# Altium project foxbms2-master.PrjPcb (part 1 of 8)
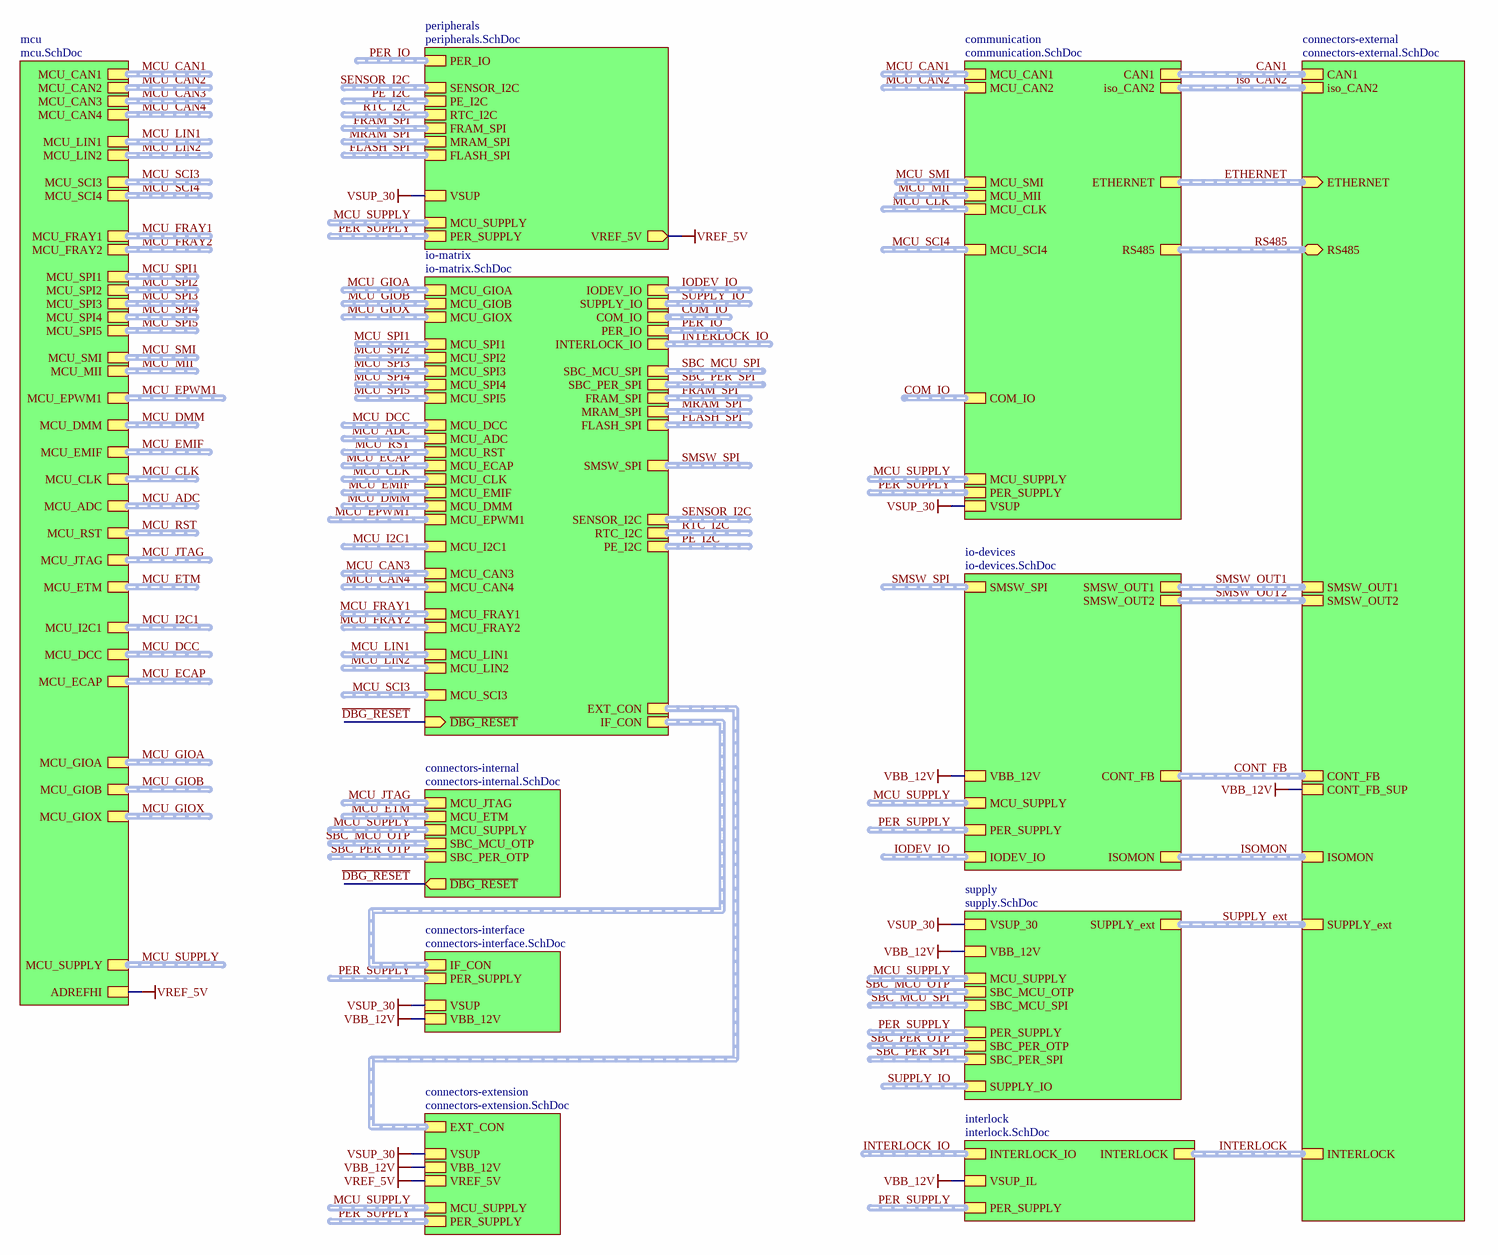
[diagram p0: foxbms2-master.SchDoc]
GlobalDate: 2022-10-25; GlobalLicense: Creative Commons Attribution 4.0; GlobalProject: foxBMS 2 Master; GlobalVersion: 1.1.5
46 sheets, 900 parts. Net scope: strictly hierarchical (ports join the sheet entries above them; power ports are local).
Board file: foxbms2-master.PcbDoc
Sheets:
  foxbms2-master.SchDoc
    mcu = mcu.SchDoc
      mcu-com-gpio-tim = mcu-com-gpio-tim.SchDoc
      mcu-supply = mcu-supply.SchDoc
      mcu-emif-etm-dmm = mcu-emif-etm-dmm.SchDoc
      mcu-misc = mcu-misc.SchDoc
      mcu-adc = mcu-adc.SchDoc
    connectors-external = connectors-external.SchDoc
    connectors-internal = connectors-internal.SchDoc
    communication = communication.SchDoc
      can = can.SchDoc
        can-transceiver1 = can-transceiver.SchDoc
        can-transceiver2 = can-transceiver.SchDoc
        digital-isolator-can = digital-isolator-3in-1out-power.SchDoc
      ethernet = ethernet.SchDoc
        ethernet-phy = ethernet-phy.SchDoc
      uart = uart.SchDoc
        rs232-rs485-transceiver = rs232-rs485-transceiver.SchDoc
    peripherals = peripherals.SchDoc
      clock = clock.SchDoc
        oscillator-20MHz = oscillator-20MHz.SchDoc
        oscillator-25MHz = oscillator-25MHz.SchDoc
      window-watchdog = window-watchdog.SchDoc
      memory = memory.SchDoc
        fram = fram.SchDoc
        mram = mram.SchDoc
        flash = flash.SchDoc
      sensor-hum-temp = sensor-hum-temp.SchDoc
      rtc = rtc.SchDoc
      port-expanders = port-expanders.SchDoc
        port-expander1 = port-expander.SchDoc
        port-expander2 = port-expander.SchDoc
        port-expander3 = port-expander.SchDoc
      vref-5.0V = voltage-reference-5.0V.SchDoc
    io-devices = io-devices.SchDoc
      smart-switches = smart-switches.SchDoc
        smart-switch1 = smart-switch.SchDoc
        smart-switch2 = smart-switch.SchDoc
      contactor-feedback = contactor-feedback.SchDoc
        contactor-feedback-divider1 = contactor-feedback-divider.SchDoc
        contactor-feedback-divider2 = contactor-feedback-divider.SchDoc
        contactor-feedback-divider3 = contactor-feedback-divider.SchDoc
        contactor-feedback-divider4 = contactor-feedback-divider.SchDoc
        contactor-feedback-divider5 = contactor-feedback-divider.SchDoc
        contactor-feedback-divider6 = contactor-feedback-divider.SchDoc
        contactor-feedback-divider7 = contactor-feedback-divider.SchDoc
        contactor-feedback-divider8 = contactor-feedback-divider.SchDoc
      insulation-monitoring = insulation-monitoring.SchDoc
    supply = supply.SchDoc
      buck-boost-converter = buck-boost-converter.SchDoc
      supply-protection-30 = supply-protection.SchDoc
      sbcs = sbcs.SchDoc
        sbc-mcu = sbc-base.SchDoc
        sbc-per = sbc-base.SchDoc
      supply-protection-30C = supply-protection.SchDoc
    io-matrix = io-matrix.SchDoc
    interlock = interlock.SchDoc
    connectors-interface = connectors-interface.SchDoc
    connectors-extension = connectors-extension.SchDoc

## Sheet foxbms2-master.SchDoc
size A3; SheetDescription: Top-Level Structure of foxBMS 2 Master; DocumentNumber: 1; SheetNumber: 1; SheetTotal: 45

### Sub-sheets
communication = communication.SchDoc: VSUP, PER_SUPPLY (harness PER_SUPPLY), MCU_SUPPLY (harness MCU_SUPPLY), iso_CAN2 (harness CAN), CAN1 (harness CAN), ETHERNET (harness ETHERNET), MCU_MII (harness MCU_MII), MCU_SMI (harness MCU_SMI), MCU_CLK (harness CLOCK), MCU_SCI4 (harness MCU_SCI), MCU_CAN2 (harness MCU_CAN), MCU_CAN1 (harness MCU_CAN), COM_IO (harness COM_IO), RS485 (harness RS485)
connectors-extension = connectors-extension.SchDoc: PER_SUPPLY (harness PER_SUPPLY), VBB_12V, VSUP, EXT_CON (harness EXT_CON), MCU_SUPPLY (harness MCU_SUPPLY), VREF_5V
connectors-external = connectors-external.SchDoc: ETHERNET (in, harness ETHERNET), iso_CAN2 (harness CAN), CAN1 (harness CAN), SMSW_OUT1 (harness SMSW_OUT), SMSW_OUT2 (harness SMSW_OUT), SUPPLY_ext (harness SUPPLY_EXT), CONT_FB_SUP, CONT_FB (harness PE_IO), ISOMON (harness ISOMON), INTERLOCK (harness INTERLOCK), RS485 (bidir, harness RS485)
connectors-interface = connectors-interface.SchDoc: PER_SUPPLY (harness PER_SUPPLY), IF_CON (harness INTERFACE_CON), VBB_12V, VSUP
connectors-internal = connectors-internal.SchDoc: MCU_JTAG (harness MCU_JTAG), SBC_MCU_OTP (harness SBC_OTP), SBC_PER_OTP (harness SBC_OTP), MCU_ETM (harness MCU_ETM), MCU_SUPPLY (harness MCU_SUPPLY), ~{DBG_RESET} (out)
interlock = interlock.SchDoc: PER_SUPPLY (harness PER_SUPPLY), VSUP_IL, INTERLOCK_IO (harness INTERLOCK_IO), INTERLOCK (harness INTERLOCK)
io-devices = io-devices.SchDoc: CONT_FB (harness PE_IO), SMSW_OUT1 (harness SMSW_OUT), SMSW_OUT2 (harness SMSW_OUT), ISOMON (harness ISOMON), IODEV_IO (harness IODEV_IO), SMSW_SPI (harness SPI), VBB_12V, PER_SUPPLY (harness PER_SUPPLY), MCU_SUPPLY (harness MCU_SUPPLY)
io-matrix = io-matrix.SchDoc: IODEV_IO (harness IODEV_IO), COM_IO (harness COM_IO), MCU_GIOB (harness MCU_GIOB), MCU_GIOA (harness MCU_GIOA), MCU_GIOX (harness MCU_GIOX), SBC_MCU_SPI (harness SPI), FRAM_SPI (harness SPI), MCU_SPI1 (harness MCU_SPI1), MCU_SPI2 (harness MCU_SPI2), MCU_SPI4 (harness MCU_SPI4), MRAM_SPI (harness SPI), SENSOR_I2C (harness I2C), MCU_DCC (harness MCU_DCC), MCU_ADC (harness MCU_ADC), MCU_RST (harness MCU_RST), RTC_I2C (harness I2C), FLASH_SPI (harness SPI), MCU_ECAP (harness MCU_ECAP), PE_I2C (harness I2C), SBC_PER_SPI (harness SPI), MCU_CLK (harness CLOCK), SMSW_SPI (harness SPI), INTERLOCK_IO (harness INTERLOCK_IO), SUPPLY_IO (harness SUPPLY_IO), PER_IO (harness PER_IO), ~{DBG_RESET} (in), MCU_SPI5 (harness MCU_SPI5), EXT_CON (harness EXT_CON), IF_CON (harness INTERFACE_CON), MCU_SPI3 (harness MCU_SPI3), MCU_I2C1 (harness MCU_I2C), MCU_LIN2 (harness MCU_LIN), MCU_FRAY1 (harness MCU_FRAY), MCU_FRAY2 (harness MCU_FRAY), MCU_LIN1 (harness MCU_LIN), MCU_EMIF (harness MCU_EMIF), MCU_EPWM1 (harness MCU_EPWM), MCU_DMM (harness MCU_DMM), MCU_CAN3 (harness MCU_CAN), MCU_CAN4 (harness MCU_CAN), MCU_SCI3 (harness MCU_SCI)
mcu = mcu.SchDoc: ADREFHI, MCU_EPWM1 (harness MCU_EPWM), MCU_LIN2 (harness MCU_LIN), MCU_FRAY2 (harness MCU_FRAY), MCU_CAN4 (harness MCU_CAN), MCU_CAN3 (harness MCU_CAN), MCU_SPI2 (harness MCU_SPI2), MCU_SCI3 (harness MCU_SCI), MCU_CAN1 (harness MCU_CAN), MCU_DMM (harness MCU_DMM), MCU_EMIF (harness MCU_EMIF), MCU_CLK (harness CLOCK), MCU_RST (harness MCU_RST), MCU_JTAG (harness MCU_JTAG), MCU_ETM (harness MCU_ETM), MCU_CAN2 (harness MCU_CAN), MCU_SPI5 (harness MCU_SPI5), MCU_SPI4 (harness MCU_SPI4), MCU_I2C1 (harness MCU_I2C), MCU_SMI (harness MCU_SMI), MCU_SPI3 (harness MCU_SPI3), MCU_MII (harness MCU_MII), MCU_SPI1 (harness MCU_SPI1), MCU_LIN1 (harness MCU_LIN), MCU_FRAY1 (harness MCU_FRAY), MCU_SCI4 (harness MCU_SCI), MCU_SUPPLY (harness MCU_SUPPLY), MCU_GIOB (harness MCU_GIOB), MCU_GIOA (harness MCU_GIOA), MCU_DCC (harness MCU_DCC), MCU_ECAP (harness MCU_ECAP), MCU_ADC (harness MCU_ADC), MCU_GIOX (harness MCU_GIOX)
peripherals = peripherals.SchDoc: MCU_SUPPLY (harness MCU_SUPPLY), PER_SUPPLY (harness PER_SUPPLY), VSUP, SENSOR_I2C (harness I2C), PE_I2C (harness I2C), RTC_I2C (harness I2C), MRAM_SPI (harness SPI), FLASH_SPI (harness SPI), FRAM_SPI (harness SPI), PER_IO (harness PER_IO), VREF_5V (out)
supply = supply.SchDoc: SBC_PER_OTP (harness SBC_OTP), SBC_MCU_OTP (harness SBC_OTP), PER_SUPPLY (harness PER_SUPPLY), MCU_SUPPLY (harness MCU_SUPPLY), SUPPLY_ext (harness SUPPLY_EXT), VSUP_30, VBB_12V, SBC_PER_SPI (harness SPI), SUPPLY_IO (harness SUPPLY_IO), SBC_MCU_SPI (harness SPI)

### Nets
VBB_12V: sheet connectors-external/CONT_FB_SUP, sheet io-devices/VBB_12V, sheet supply/VBB_12V, sheet interlock/VSUP_IL, sheet connectors-interface/VBB_12V, sheet connectors-extension/VBB_12V
VREF_5V: sheet mcu/ADREFHI, sheet peripherals/VREF_5V, sheet connectors-extension/VREF_5V
VSUP_30: sheet communication/VSUP, sheet peripherals/VSUP, sheet supply/VSUP_30, sheet connectors-interface/VSUP, sheet connectors-extension/VSUP
~{DBG_RESET}: sheet connectors-internal/~{DBG_RESET}, sheet io-matrix/~{DBG_RESET}

### Buses and harness runs
harness CAN1 = sheet communication/CAN1 = sheet connectors-external/CAN1
harness COM_IO = sheet communication/COM_IO
harness COM_IO = sheet io-matrix/COM_IO
harness CONT_FB = sheet connectors-external/CONT_FB = sheet io-devices/CONT_FB
harness ETHERNET = sheet communication/ETHERNET = sheet connectors-external/ETHERNET
harness FLASH_SPI = sheet io-matrix/FLASH_SPI
harness FLASH_SPI = sheet peripherals/FLASH_SPI
harness FRAM_SPI = sheet io-matrix/FRAM_SPI
harness FRAM_SPI = sheet peripherals/FRAM_SPI
harness INTERLOCK = sheet connectors-external/INTERLOCK = sheet interlock/INTERLOCK
harness INTERLOCK_IO = sheet interlock/INTERLOCK_IO
harness INTERLOCK_IO = sheet io-matrix/INTERLOCK_IO
harness IODEV_IO = sheet io-devices/IODEV_IO
harness IODEV_IO = sheet io-matrix/IODEV_IO
harness iso_CAN2 = sheet communication/iso_CAN2 = sheet connectors-external/iso_CAN2
harness ISOMON = sheet connectors-external/ISOMON = sheet io-devices/ISOMON
harness MCU_ADC = sheet io-matrix/MCU_ADC
harness MCU_ADC = sheet mcu/MCU_ADC
harness MCU_CAN1 = sheet communication/MCU_CAN1
harness MCU_CAN1 = sheet mcu/MCU_CAN1
harness MCU_CAN2 = sheet communication/MCU_CAN2
harness MCU_CAN2 = sheet mcu/MCU_CAN2
harness MCU_CAN3 = sheet io-matrix/MCU_CAN3
harness MCU_CAN3 = sheet mcu/MCU_CAN3
harness MCU_CAN4 = sheet io-matrix/MCU_CAN4
harness MCU_CAN4 = sheet mcu/MCU_CAN4
harness MCU_CLK = sheet communication/MCU_CLK
harness MCU_CLK = sheet io-matrix/MCU_CLK
harness MCU_CLK = sheet mcu/MCU_CLK
harness MCU_DCC = sheet io-matrix/MCU_DCC
harness MCU_DCC = sheet mcu/MCU_DCC
harness MCU_DMM = sheet io-matrix/MCU_DMM
harness MCU_DMM = sheet mcu/MCU_DMM
harness MCU_ECAP = sheet io-matrix/MCU_ECAP
harness MCU_ECAP = sheet mcu/MCU_ECAP
harness MCU_EMIF = sheet io-matrix/MCU_EMIF
harness MCU_EMIF = sheet mcu/MCU_EMIF
harness MCU_EPWM1 = sheet io-matrix/MCU_EPWM1
harness MCU_EPWM1 = sheet mcu/MCU_EPWM1
harness MCU_ETM = sheet connectors-internal/MCU_ETM
harness MCU_ETM = sheet mcu/MCU_ETM
harness MCU_FRAY1 = sheet io-matrix/MCU_FRAY1
harness MCU_FRAY1 = sheet mcu/MCU_FRAY1
harness MCU_FRAY2 = sheet io-matrix/MCU_FRAY2
harness MCU_FRAY2 = sheet mcu/MCU_FRAY2
harness MCU_GIOA = sheet io-matrix/MCU_GIOA
harness MCU_GIOA = sheet mcu/MCU_GIOA
harness MCU_GIOB = sheet io-matrix/MCU_GIOB
harness MCU_GIOB = sheet mcu/MCU_GIOB
harness MCU_GIOX = sheet io-matrix/MCU_GIOX
harness MCU_GIOX = sheet mcu/MCU_GIOX
harness MCU_I2C1 = sheet io-matrix/MCU_I2C1
harness MCU_I2C1 = sheet mcu/MCU_I2C1
harness MCU_JTAG = sheet connectors-internal/MCU_JTAG
harness MCU_JTAG = sheet mcu/MCU_JTAG
harness MCU_LIN1 = sheet io-matrix/MCU_LIN1
harness MCU_LIN1 = sheet mcu/MCU_LIN1
harness MCU_LIN2 = sheet io-matrix/MCU_LIN2
harness MCU_LIN2 = sheet mcu/MCU_LIN2
harness MCU_MII = sheet communication/MCU_MII
harness MCU_MII = sheet mcu/MCU_MII
harness MCU_RST = sheet io-matrix/MCU_RST
harness MCU_RST = sheet mcu/MCU_RST
harness MCU_SCI3 = sheet io-matrix/MCU_SCI3
harness MCU_SCI3 = sheet mcu/MCU_SCI3
harness MCU_SCI4 = sheet communication/MCU_SCI4
harness MCU_SCI4 = sheet mcu/MCU_SCI4
harness MCU_SMI = sheet communication/MCU_SMI
harness MCU_SMI = sheet mcu/MCU_SMI
harness MCU_SPI1 = sheet io-matrix/MCU_SPI1
harness MCU_SPI1 = sheet mcu/MCU_SPI1
harness MCU_SPI2 = sheet io-matrix/MCU_SPI2
harness MCU_SPI2 = sheet mcu/MCU_SPI2
harness MCU_SPI3 = sheet io-matrix/MCU_SPI3
harness MCU_SPI3 = sheet mcu/MCU_SPI3
harness MCU_SPI4 = sheet io-matrix/MCU_SPI4
harness MCU_SPI4 = sheet mcu/MCU_SPI4
harness MCU_SPI5 = sheet io-matrix/MCU_SPI5
harness MCU_SPI5 = sheet mcu/MCU_SPI5
harness MCU_SUPPLY = sheet communication/MCU_SUPPLY
harness MCU_SUPPLY = sheet connectors-extension/MCU_SUPPLY
harness MCU_SUPPLY = sheet connectors-internal/MCU_SUPPLY
harness MCU_SUPPLY = sheet io-devices/MCU_SUPPLY
harness MCU_SUPPLY = sheet mcu/MCU_SUPPLY
harness MCU_SUPPLY = sheet peripherals/MCU_SUPPLY
harness MCU_SUPPLY = sheet supply/MCU_SUPPLY
harness MRAM_SPI = sheet io-matrix/MRAM_SPI
harness MRAM_SPI = sheet peripherals/MRAM_SPI
harness PE_I2C = sheet io-matrix/PE_I2C
harness PE_I2C = sheet peripherals/PE_I2C
harness PER_IO = sheet io-matrix/PER_IO
harness PER_IO = sheet peripherals/PER_IO
harness PER_SUPPLY = sheet communication/PER_SUPPLY
harness PER_SUPPLY = sheet connectors-extension/PER_SUPPLY
harness PER_SUPPLY = sheet connectors-interface/PER_SUPPLY
harness PER_SUPPLY = sheet interlock/PER_SUPPLY
harness PER_SUPPLY = sheet io-devices/PER_SUPPLY
harness PER_SUPPLY = sheet peripherals/PER_SUPPLY
harness PER_SUPPLY = sheet supply/PER_SUPPLY
harness RS485 = sheet communication/RS485 = sheet connectors-external/RS485
harness RTC_I2C = sheet io-matrix/RTC_I2C
harness RTC_I2C = sheet peripherals/RTC_I2C
harness SBC_MCU_OTP = sheet connectors-internal/SBC_MCU_OTP
harness SBC_MCU_OTP = sheet supply/SBC_MCU_OTP
harness SBC_MCU_SPI = sheet io-matrix/SBC_MCU_SPI
harness SBC_MCU_SPI = sheet supply/SBC_MCU_SPI
harness SBC_PER_OTP = sheet connectors-internal/SBC_PER_OTP
harness SBC_PER_OTP = sheet supply/SBC_PER_OTP
harness SBC_PER_SPI = sheet io-matrix/SBC_PER_SPI
harness SBC_PER_SPI = sheet supply/SBC_PER_SPI
harness SENSOR_I2C = sheet io-matrix/SENSOR_I2C
harness SENSOR_I2C = sheet peripherals/SENSOR_I2C
harness sheet connectors-extension/EXT_CON = sheet io-matrix/EXT_CON
harness sheet connectors-interface/IF_CON = sheet io-matrix/IF_CON
harness SMSW_OUT1 = sheet connectors-external/SMSW_OUT1 = sheet io-devices/SMSW_OUT1
harness SMSW_OUT2 = sheet connectors-external/SMSW_OUT2 = sheet io-devices/SMSW_OUT2
harness SMSW_SPI = sheet io-devices/SMSW_SPI
harness SMSW_SPI = sheet io-matrix/SMSW_SPI
harness SUPPLY_ext = sheet connectors-external/SUPPLY_ext = sheet supply/SUPPLY_ext
harness SUPPLY_IO = sheet io-matrix/SUPPLY_IO
harness SUPPLY_IO = sheet supply/SUPPLY_IO

### Notes on the sheet
- Fraunhofer IISB
- Schottkystr. 10
- developed by:
- 91058 Erlangen
- Germany
- Author
- Project
- License
- Description
- File
- Version
- Release Date
- Sheet
- foxbms.org <https://foxbms.org>
- www.iisb.fraunhofer.de <https://www.iisb.fraunhofer.de/>
- foxBMS Team
- /

## Sheet mcu.SchDoc
size A3; DocumentNumber: 22; SheetNumber: 22; SheetTotal: 45; SheetDescription: Microcontroller Unit
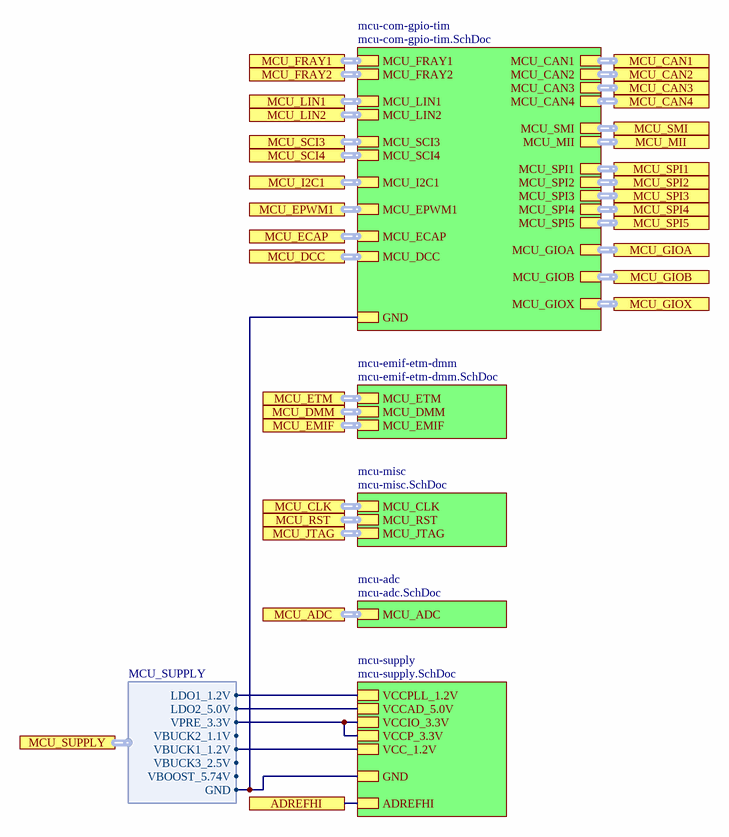
[diagram p1: mcu.SchDoc]

### Sub-sheets
mcu-adc = mcu-adc.SchDoc: MCU_ADC (harness MCU_ADC)
mcu-com-gpio-tim = mcu-com-gpio-tim.SchDoc: MCU_FRAY1 (harness MCU_FRAY), MCU_LIN1 (harness MCU_LIN), MCU_SPI1 (harness MCU_SPI1), MCU_MII (harness MCU_MII), MCU_SPI3 (harness MCU_SPI3), MCU_SMI (harness MCU_SMI), MCU_SPI5 (harness MCU_SPI5), MCU_LIN2 (harness MCU_LIN), MCU_SPI4 (harness MCU_SPI4), MCU_SPI2 (harness MCU_SPI2), MCU_EPWM1 (harness MCU_EPWM), MCU_I2C1 (harness MCU_I2C), MCU_SCI3 (harness MCU_SCI), MCU_CAN1 (harness MCU_CAN), MCU_CAN2 (harness MCU_CAN), MCU_FRAY2 (harness MCU_FRAY), MCU_CAN4 (harness MCU_CAN), MCU_CAN3 (harness MCU_CAN), MCU_SCI4 (harness MCU_SCI), MCU_ECAP (harness MCU_ECAP), MCU_DCC (harness MCU_DCC), MCU_GIOB (harness MCU_GIOB), MCU_GIOA (harness MCU_GIOA), GND, MCU_GIOX (harness MCU_GIOX)
mcu-emif-etm-dmm = mcu-emif-etm-dmm.SchDoc: MCU_ETM (harness MCU_ETM), MCU_DMM (harness MCU_DMM), MCU_EMIF (harness MCU_EMIF)
mcu-misc = mcu-misc.SchDoc: MCU_CLK (harness CLOCK), MCU_RST (harness MCU_RST), MCU_JTAG (harness MCU_JTAG)
mcu-supply = mcu-supply.SchDoc: VCCP_3.3V, VCCAD_5.0V, VCCPLL_1.2V, VCC_1.2V, VCCIO_3.3V, GND, ADREFHI

### Ports
ADREFHI, MCU_ADC (harness MCU_ADC), MCU_CAN1 (harness MCU_CAN), MCU_CAN2 (harness MCU_CAN), MCU_CAN3 (harness MCU_CAN), MCU_CAN4 (harness MCU_CAN), MCU_CLK (harness CLOCK), MCU_DCC (harness MCU_DCC), MCU_DMM (harness MCU_DMM), MCU_ECAP (harness MCU_ECAP), MCU_EMIF (harness MCU_EMIF), MCU_EPWM1 (harness MCU_EPWM), MCU_ETM (harness MCU_ETM), MCU_FRAY1 (harness MCU_FRAY), MCU_FRAY2 (harness MCU_FRAY), MCU_GIOA (harness MCU_GIOA), MCU_GIOB (harness MCU_GIOB), MCU_GIOX (harness MCU_GIOX), MCU_I2C1 (harness MCU_I2C), MCU_JTAG (harness MCU_JTAG), MCU_LIN1 (harness MCU_LIN), MCU_LIN2 (harness MCU_LIN), MCU_MII (harness MCU_MII), MCU_RST (harness MCU_RST), MCU_SCI3 (harness MCU_SCI), MCU_SCI4 (harness MCU_SCI), MCU_SMI (harness MCU_SMI), MCU_SPI1 (harness MCU_SPI1), MCU_SPI2 (harness MCU_SPI2), MCU_SPI3 (harness MCU_SPI3), MCU_SPI4 (harness MCU_SPI4), MCU_SPI5 (harness MCU_SPI5), MCU_SUPPLY (harness MCU_SUPPLY)

### Harnesses
MCU_SUPPLY: VBUCK1_1.2V, VBUCK2_1.1V, VBUCK3_2.5V, LDO1_1.2V, LDO2_5.0V, GND, VPRE_3.3V, VBOOST_5.74V

### Nets
GND: sheet mcu-com-gpio-tim/GND, sheet mcu-supply/GND, port MCU_SUPPLY.GND
MCU_1.2V: sheet mcu-supply/VCC_1.2V, port MCU_SUPPLY.VBUCK1_1.2V
MCU_1.2V_LDO: sheet mcu-supply/VCCPLL_1.2V, port MCU_SUPPLY.LDO1_1.2V
MCU_3.3V: sheet mcu-supply/VCCP_3.3V, sheet mcu-supply/VCCIO_3.3V, port MCU_SUPPLY.VPRE_3.3V
MCU_5.0V_LDO: sheet mcu-supply/VCCAD_5.0V, port MCU_SUPPLY.LDO2_5.0V
VREF_5V: port ADREFHI, sheet mcu-supply/ADREFHI

### Buses and harness runs
harness port MCU_ADC = sheet mcu-adc/MCU_ADC
harness port MCU_CAN1 = sheet mcu-com-gpio-tim/MCU_CAN1
harness port MCU_CAN2 = sheet mcu-com-gpio-tim/MCU_CAN2
harness port MCU_CAN3 = sheet mcu-com-gpio-tim/MCU_CAN3
harness port MCU_CAN4 = sheet mcu-com-gpio-tim/MCU_CAN4
harness port MCU_CLK = sheet mcu-misc/MCU_CLK
harness port MCU_DCC = sheet mcu-com-gpio-tim/MCU_DCC
harness port MCU_DMM = sheet mcu-emif-etm-dmm/MCU_DMM
harness port MCU_ECAP = sheet mcu-com-gpio-tim/MCU_ECAP
harness port MCU_EMIF = sheet mcu-emif-etm-dmm/MCU_EMIF
harness port MCU_EPWM1 = sheet mcu-com-gpio-tim/MCU_EPWM1
harness port MCU_ETM = sheet mcu-emif-etm-dmm/MCU_ETM
harness port MCU_FRAY1 = sheet mcu-com-gpio-tim/MCU_FRAY1
harness port MCU_FRAY2 = sheet mcu-com-gpio-tim/MCU_FRAY2
harness port MCU_GIOA = sheet mcu-com-gpio-tim/MCU_GIOA
harness port MCU_GIOB = sheet mcu-com-gpio-tim/MCU_GIOB
harness port MCU_GIOX = sheet mcu-com-gpio-tim/MCU_GIOX
harness port MCU_I2C1 = sheet mcu-com-gpio-tim/MCU_I2C1
harness port MCU_JTAG = sheet mcu-misc/MCU_JTAG
harness port MCU_LIN1 = sheet mcu-com-gpio-tim/MCU_LIN1
harness port MCU_LIN2 = sheet mcu-com-gpio-tim/MCU_LIN2
harness port MCU_MII = sheet mcu-com-gpio-tim/MCU_MII
harness port MCU_RST = sheet mcu-misc/MCU_RST
harness port MCU_SCI3 = sheet mcu-com-gpio-tim/MCU_SCI3
harness port MCU_SCI4 = sheet mcu-com-gpio-tim/MCU_SCI4
harness port MCU_SMI = sheet mcu-com-gpio-tim/MCU_SMI
harness port MCU_SPI1 = sheet mcu-com-gpio-tim/MCU_SPI1
harness port MCU_SPI2 = sheet mcu-com-gpio-tim/MCU_SPI2
harness port MCU_SPI3 = sheet mcu-com-gpio-tim/MCU_SPI3
harness port MCU_SPI4 = sheet mcu-com-gpio-tim/MCU_SPI4
harness port MCU_SPI5 = sheet mcu-com-gpio-tim/MCU_SPI5

### Notes on the sheet
- Fraunhofer IISB
- Schottkystr. 10
- developed by:
- 91058 Erlangen
- Germany
- Author
- Project
- License
- Description
- File
- Version
- Release Date
- Sheet
- foxbms.org <https://foxbms.org>
- www.iisb.fraunhofer.de <https://www.iisb.fraunhofer.de/>
- foxBMS Team
- /

## Sheet mcu-com-gpio-tim.SchDoc
size A3; DocumentNumber: 24; SheetNumber: 24; SheetTotal: 45; SheetDescription: MCU COM, GPIO and TIM
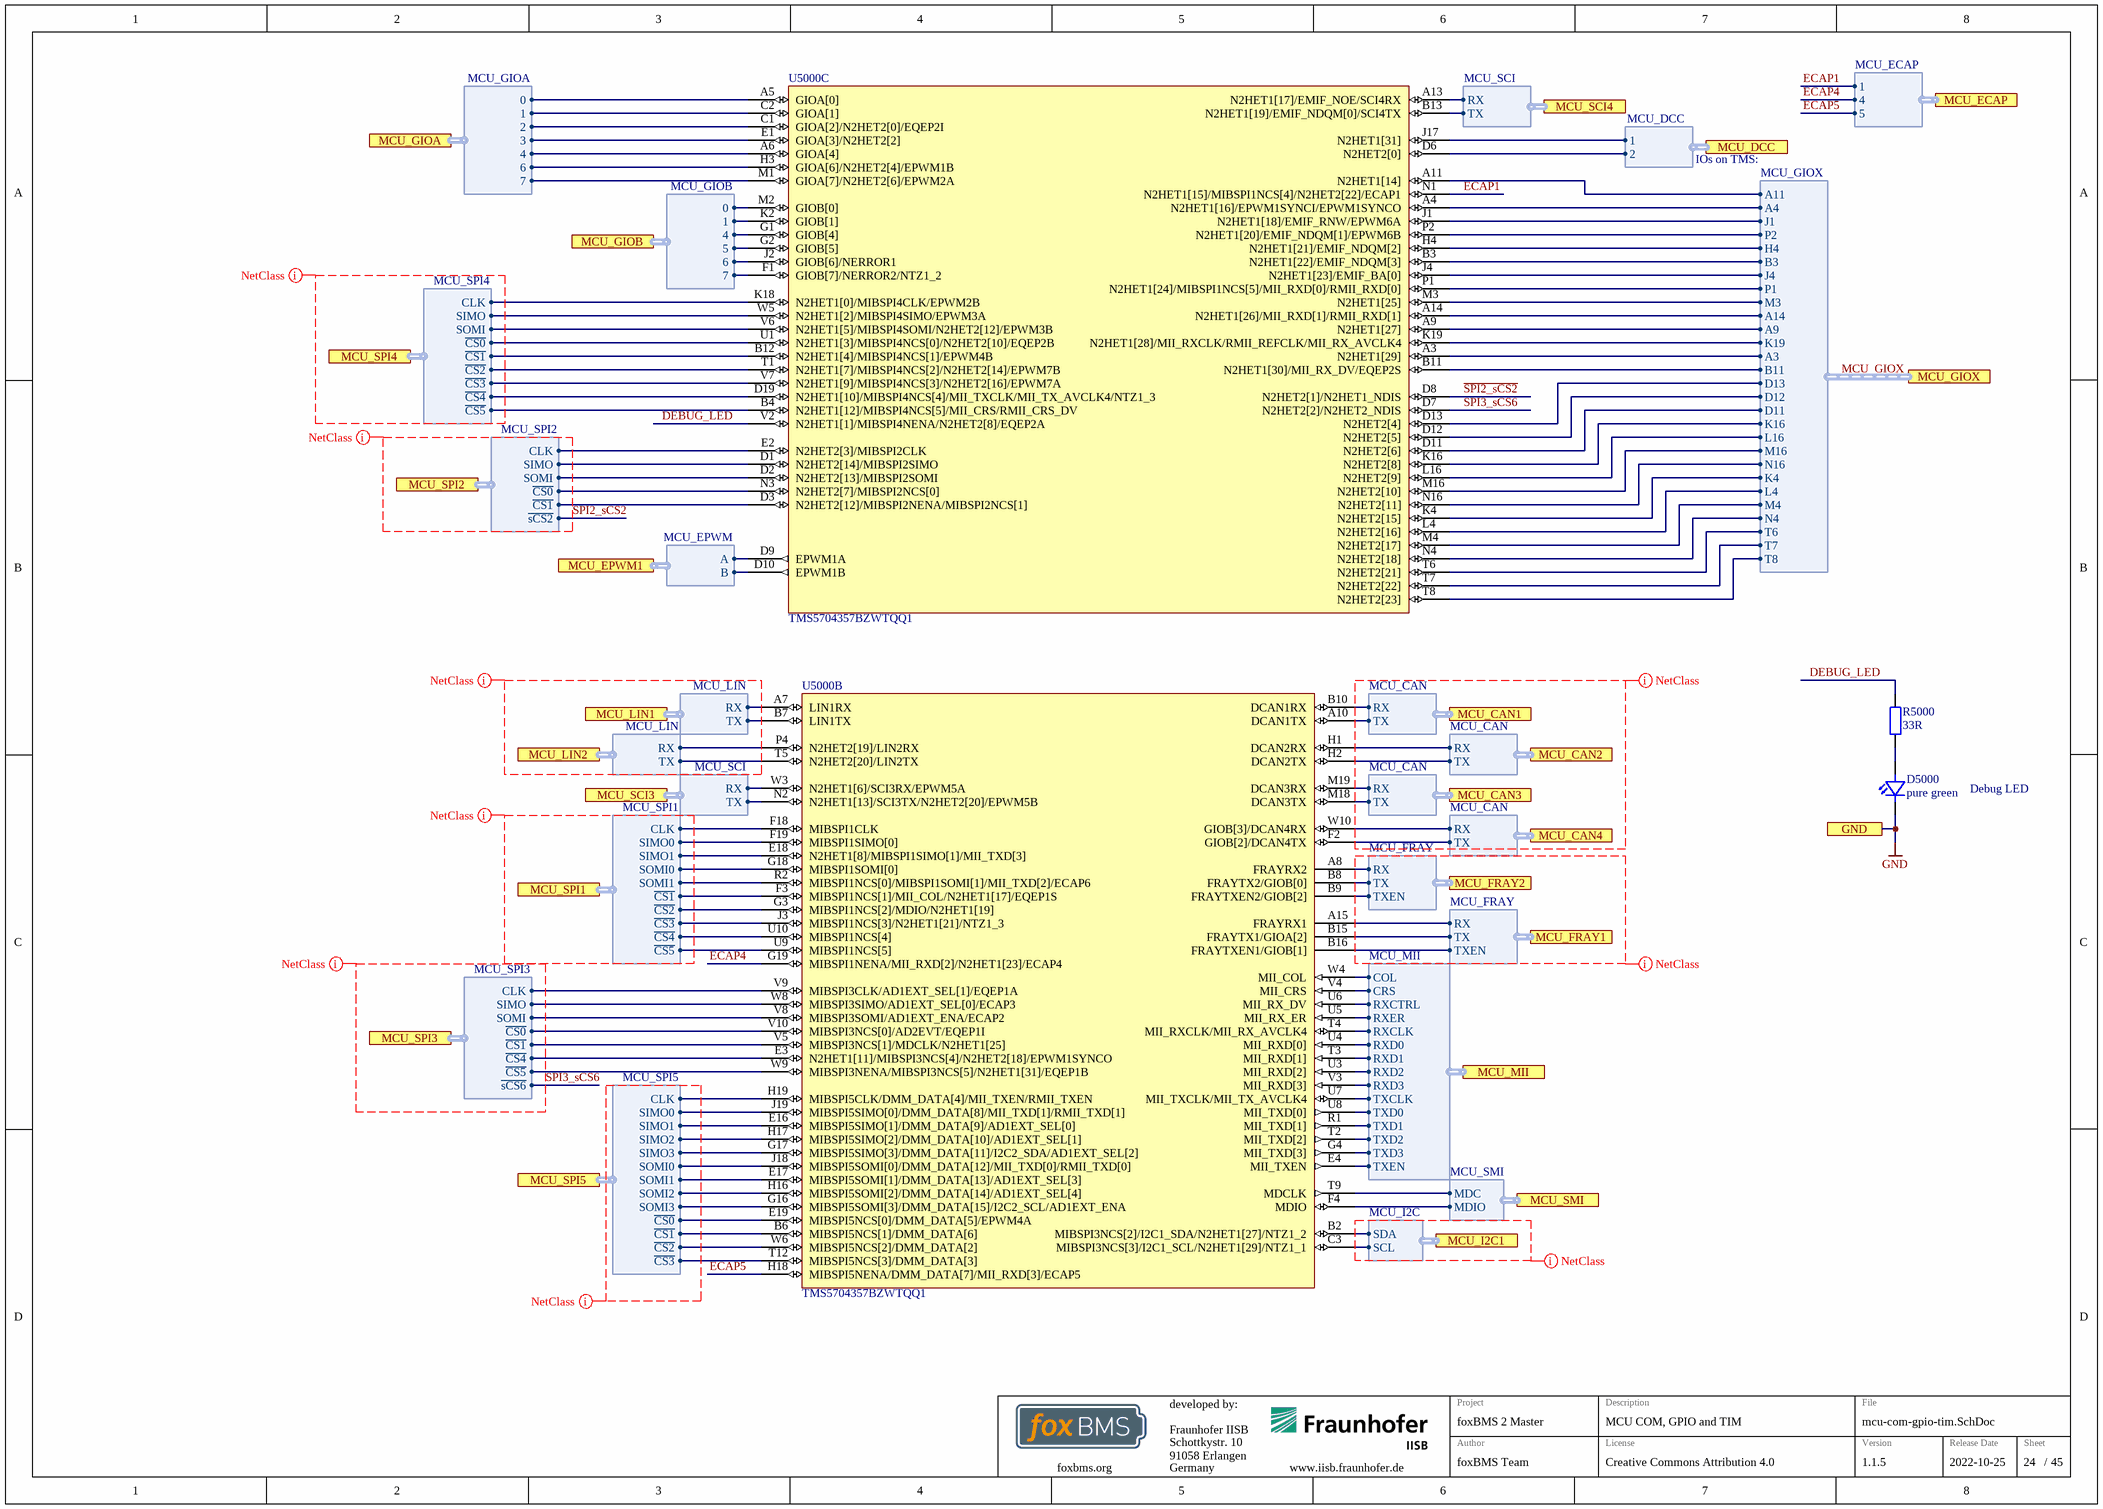
[diagram p2: mcu-com-gpio-tim.SchDoc]

### Parts
D5000  pure green  [LEDC1608X07N]
R5000  33R  [RESC1005X04N]
U5000  TMS5704357BZWTQQ1  [BGA337C80P19X19_1600X1600X140]  (parts B,C of 6)

### Ports
GND, MCU_CAN1 (harness MCU_CAN), MCU_CAN2 (harness MCU_CAN), MCU_CAN3 (harness MCU_CAN), MCU_CAN4 (harness MCU_CAN), MCU_DCC (harness MCU_DCC), MCU_ECAP (harness MCU_ECAP), MCU_EPWM1 (harness MCU_EPWM), MCU_FRAY1 (harness MCU_FRAY), MCU_FRAY2 (harness MCU_FRAY), MCU_GIOA (harness MCU_GIOA), MCU_GIOB (harness MCU_GIOB), MCU_GIOX (harness MCU_GIOX), MCU_I2C1 (harness MCU_I2C), MCU_LIN1 (harness MCU_LIN), MCU_LIN2 (harness MCU_LIN), MCU_MII (harness MCU_MII), MCU_SCI3 (harness MCU_SCI), MCU_SCI4 (harness MCU_SCI), MCU_SMI (harness MCU_SMI), MCU_SPI1 (harness MCU_SPI1), MCU_SPI2 (harness MCU_SPI2), MCU_SPI3 (harness MCU_SPI3), MCU_SPI4 (harness MCU_SPI4), MCU_SPI5 (harness MCU_SPI5)

### Harnesses
MCU_CAN: RX, TX
MCU_FRAY: RX, TX, TXEN
MCU_SMI: MDC, MDIO
MCU_MII: TXD0, TXD1, TXD2, TXD3, TXEN, TXCLK, RXCTRL, RXCLK, RXD3, RXD2, RXD0, RXD1, RXER, COL, CRS
MCU_LIN: RX, TX
MCU_SPI1: CLK, SIMO0, SOMI0, SOMI1, ~{CS1}, ~{CS2}, ~{CS3}, ~{CS4}, ~{CS5}, SIMO1
MCU_SPI3: CLK, SIMO, SOMI, ~{CS1}, ~{CS4}, ~{CS5}, ~{CS0}, ~{sCS6}
MCU_SPI5: CLK, SIMO0, SOMI0, SOMI1, ~{CS1}, ~{CS2}, ~{CS3}, ~{CS0}, SIMO1, SIMO2, SIMO3, SOMI2, SOMI3
MCU_SCI: RX, TX
MCU_I2C: SDA, SCL
MCU_SPI4: CLK, SIMO, SOMI, ~{CS1}, ~{CS2}, ~{CS3}, ~{CS0}, ~{CS4}, ~{CS5}
MCU_SPI2: CLK, SIMO, SOMI, ~{CS1}, ~{CS0}, ~{sCS2}
MCU_EPWM: A, B
MCU_GIOA: 0, 1, 2, 3, 4, 6, 7
MCU_GIOB: 0, 1, 4, 5, 6, 7
MCU_DCC: 1, 2
MCU_ECAP: 1, 4, 5
MCU_GIOX: A11, A4, J1, P2, H4, B3, J4, P1, M3, A14, A9, K19, A3, B11, D13, D12, D11, K16, L16, M16, N16, K4, L4, M4, N4, T6, T7, T8

### Nets
GND: D5000.1(C) U5000.V4(MII_CRS) U5000.W4(MII_COL) ; port GND, port MCU_MII.COL, port MCU_MII.CRS
~{SPI2_sCS2}: U5000.D8(N2HET2[1]/N2HET1_NDIS) ; port MCU_SPI2.~{sCS2}  [project net MCU_SPI2~{.}sCS2]
~{SPI3_sCS6}: U5000.D7(N2HET2[2]/N2HET2_NDIS) ; port MCU_SPI3.~{sCS6}  [project net MCU_SPI3~{.}sCS6]
COM_IO~{.}ETH_INT: U5000.J2(GIOB[6]/NERROR1) ; port MCU_GIOB.6
COM_IO.CAN_FAULT: U5000.G2(GIOB[5]) ; port MCU_GIOB.5
DEBUG_LED: R5000.2 U5000.V2(N2HET1[1]/MIBSPI4NENA/N2HET2[8]/EQEP2A)  [project net DEBUG_LED_24]
ECAP1: U5000.N1(N2HET1[15]/MIBSPI1NCS[4]/N2HET2[22]/ECAP1) ; port MCU_ECAP.1  [project net IODEV_IO.IM_PWM]
ECAP4: U5000.G19(MIBSPI1NENA/MII_RXD[2]/N2HET1[23]/ECAP4) ; port MCU_ECAP.4  [project net EXT_CON.ECAP4]
ECAP5: U5000.H18(MIBSPI5NENA/DMM_DATA[7]/MII_RXD[3]/ECAP5) ; port MCU_ECAP.5  [project net EXT_CON.ECAP5]
EXT_CON.DCC1: U5000.J17(N2HET1[31]) ; port MCU_DCC.1
EXT_CON.EPWM1A: U5000.D9(EPWM1A) ; port MCU_EPWM1.A
EXT_CON.EPWM1B: U5000.D10(EPWM1B) ; port MCU_EPWM1.B
EXT_CON.IL_STATE: U5000.A3(N2HET1[29]) ; port MCU_GIOX.A3
EXT_CON.MCU_A4: U5000.A4(N2HET1[16]/EPWM1SYNCI/EPWM1SYNCO) ; port MCU_GIOX.A4
EXT_CON.MCU_A11: U5000.A11(N2HET1[14]) ; port MCU_GIOX.A11
EXT_CON.MCU_A14: U5000.A14(N2HET1[26]/MII_RXD[1]/RMII_RXD[1]) ; port MCU_GIOX.A14
EXT_CON.MCU_B3: U5000.B3(N2HET1[22]/EMIF_NDQM[3]) ; port MCU_GIOX.B3
EXT_CON.MCU_GIOA7: U5000.M1(GIOA[7]/N2HET2[6]/EPWM2A) ; port MCU_GIOA.7
EXT_CON.MCU_H4: U5000.H4(N2HET1[21]/EMIF_NDQM[2]) ; port MCU_GIOX.H4
EXT_CON.MCU_J1: U5000.J1(N2HET1[18]/EMIF_RNW/EPWM6A) ; port MCU_GIOX.J1
EXT_CON.MCU_J4: U5000.J4(N2HET1[23]/EMIF_BA[0]) ; port MCU_GIOX.J4
EXT_CON.MCU_K19: U5000.K19(N2HET1[28]/MII_RXCLK/RMII_REFCLK/MII_RX_AVCLK4) ; port MCU_GIOX.K19
EXT_CON.MCU_M16: U5000.M16(N2HET2[10]) ; port MCU_GIOX.M16
EXT_CON.MCU_N16: U5000.N16(N2HET2[11]) ; port MCU_GIOX.N16
EXT_CON.MCU_P1: U5000.P1(N2HET1[24]/MIBSPI1NCS[5]/MII_RXD[0]/RMII_RXD[0]) ; port MCU_GIOX.P1
EXT_CON.MCU_P2: U5000.P2(N2HET1[20]/EMIF_NDQM[1]/EPWM6B) ; port MCU_GIOX.P2
FLASH_SPI~{.}CS: U5000.V10(MIBSPI3NCS[0]/AD2EVT/EQEP1I) ; port MCU_SPI3.~{CS0}
FLASH_SPI.CLK: U5000.V9(MIBSPI3CLK/AD1EXT_SEL[1]/EQEP1A) ; port MCU_SPI3.CLK
FLASH_SPI.MISO: U5000.V8(MIBSPI3SOMI/AD1EXT_ENA/ECAP2) ; port MCU_SPI3.SOMI
FLASH_SPI.MOSI: U5000.W8(MIBSPI3SIMO/AD1EXT_SEL[0]/ECAP3) ; port MCU_SPI3.SIMO
FRAM_SPI~{.}CS: U5000.V5(MIBSPI3NCS[1]/MDCLK/N2HET1[25]) ; port MCU_SPI3.~{CS1}
IF_CON~{.}IF_INT0: U5000.C1(GIOA[2]/N2HET2[0]/EQEP2I) ; port MCU_GIOA.2
IF_CON~{.}IF_INT1: U5000.E1(GIOA[3]/N2HET2[2]) ; port MCU_GIOA.3
IF_CON~{.}IF_INT2: U5000.A6(GIOA[4]) ; port MCU_GIOA.4
IF_CON~{.}IF_INT3: U5000.H3(GIOA[6]/N2HET2[4]/EPWM1B) ; port MCU_GIOA.6
INTERLOCK_IO.IL_HS_ENABLE: U5000.B11(N2HET1[30]/MII_RX_DV/EQEP2S) ; port MCU_GIOX.B11
IODEV_IO~{.}SMSW_FAULT: U5000.M2(GIOB[0]) ; port MCU_GIOB.0
IODEV_IO~{.}SMSW_RESET: U5000.L4(N2HET2[16]) ; port MCU_GIOX.L4
IODEV_IO.CONT_FB_EN: U5000.L16(N2HET2[9]) ; port MCU_GIOX.L16
IODEV_IO.IM_OK: U5000.A9(N2HET1[27]) ; port MCU_GIOX.A9
IODEV_IO.IM_SUP_EN: U5000.M3(N2HET1[25]) ; port MCU_GIOX.M3
MCU_CAN1.RX: U5000.B10(DCAN1RX) ; port MCU_CAN1.RX
MCU_CAN1.TX: U5000.A10(DCAN1TX) ; port MCU_CAN1.TX
MCU_CAN2.RX: U5000.H1(DCAN2RX) ; port MCU_CAN2.RX
MCU_CAN2.TX: U5000.H2(DCAN2TX) ; port MCU_CAN2.TX
MCU_CAN3.RX: U5000.M19(DCAN3RX) ; port MCU_CAN3.RX
MCU_CAN3.TX: U5000.M18(DCAN3TX) ; port MCU_CAN3.TX
MCU_CAN4.RX: U5000.W10(GIOB[3]/DCAN4RX) ; port MCU_CAN4.RX
MCU_CAN4.TX: U5000.F2(GIOB[2]/DCAN4TX) ; port MCU_CAN4.TX
MCU_DCC.2: U5000.D6(N2HET2[0]) ; port MCU_DCC.2
MCU_FRAY1.RX: U5000.A15(FRAYRX1) ; port MCU_FRAY1.RX
MCU_FRAY1.TX: U5000.B15(FRAYTX1/GIOA[2]) ; port MCU_FRAY1.TX
MCU_FRAY1.TXEN: U5000.B16(FRAYTXEN1/GIOB[1]) ; port MCU_FRAY1.TXEN
MCU_FRAY2.RX: U5000.A8(FRAYRX2) ; port MCU_FRAY2.RX
MCU_FRAY2.TX: U5000.B8(FRAYTX2/GIOB[0]) ; port MCU_FRAY2.TX
MCU_FRAY2.TXEN: U5000.B9(FRAYTXEN2/GIOB[2]) ; port MCU_FRAY2.TXEN
MCU_GIOA.0: U5000.A5(GIOA[0]) ; port MCU_GIOA.0
MCU_GIOA.1: U5000.C2(GIOA[1]) ; port MCU_GIOA.1
MCU_GIOB.1: U5000.K2(GIOB[1]) ; port MCU_GIOB.1
MCU_GIOB.4: U5000.G1(GIOB[4]) ; port MCU_GIOB.4
MCU_GIOB.7: U5000.F1(GIOB[7]/NERROR2/NTZ1_2) ; port MCU_GIOB.7
MCU_GIOX.D11: U5000.D11(N2HET2[6]) ; port MCU_GIOX.D11
MCU_GIOX.D12: U5000.D12(N2HET2[5]) ; port MCU_GIOX.D12
MCU_GIOX.D13: U5000.D13(N2HET2[4]) ; port MCU_GIOX.D13
MCU_GIOX.K4: U5000.K4(N2HET2[15]) ; port MCU_GIOX.K4
MCU_GIOX.K16: U5000.K16(N2HET2[8]) ; port MCU_GIOX.K16
MCU_GIOX.M4: U5000.M4(N2HET2[17]) ; port MCU_GIOX.M4
MCU_GIOX.N4: U5000.N4(N2HET2[18]) ; port MCU_GIOX.N4
MCU_GIOX.T6: U5000.T6(N2HET2[21]) ; port MCU_GIOX.T6
MCU_GIOX.T7: U5000.T7(N2HET2[22]) ; port MCU_GIOX.T7
MCU_GIOX.T8: U5000.T8(N2HET2[23]) ; port MCU_GIOX.T8
MCU_I2C1.SCL: U5000.C3(MIBSPI3NCS[3]/I2C1_SCL/N2HET1[29]/NTZ1_1) ; port MCU_I2C1.SCL
MCU_I2C1.SDA: U5000.B2(MIBSPI3NCS[2]/I2C1_SDA/N2HET1[27]/NTZ1_2) ; port MCU_I2C1.SDA
MCU_LIN1.RX: U5000.A7(LIN1RX) ; port MCU_LIN1.RX
MCU_LIN1.TX: U5000.B7(LIN1TX) ; port MCU_LIN1.TX
MCU_LIN2.RX: U5000.P4(N2HET2[19]/LIN2RX) ; port MCU_LIN2.RX
MCU_LIN2.TX: U5000.T5(N2HET2[20]/LIN2TX) ; port MCU_LIN2.TX
MCU_MII.RXCLK: U5000.T4(MII_RXCLK/MII_RX_AVCLK4) ; port MCU_MII.RXCLK
MCU_MII.RXCTRL: U5000.U6(MII_RX_DV) ; port MCU_MII.RXCTRL
MCU_MII.RXD0: U5000.U4(MII_RXD[0]) ; port MCU_MII.RXD0
MCU_MII.RXD1: U5000.T3(MII_RXD[1]) ; port MCU_MII.RXD1
MCU_MII.RXD2: U5000.U3(MII_RXD[2]) ; port MCU_MII.RXD2
MCU_MII.RXD3: U5000.V3(MII_RXD[3]) ; port MCU_MII.RXD3
MCU_MII.RXER: U5000.U5(MII_RX_ER) ; port MCU_MII.RXER
MCU_MII.TXCLK: U5000.U7(MII_TXCLK/MII_TX_AVCLK4) ; port MCU_MII.TXCLK
MCU_MII.TXD0: U5000.U8(MII_TXD[0]) ; port MCU_MII.TXD0
MCU_MII.TXD1: U5000.R1(MII_TXD[1]) ; port MCU_MII.TXD1
MCU_MII.TXD2: U5000.T2(MII_TXD[2]) ; port MCU_MII.TXD2
MCU_MII.TXD3: U5000.G4(MII_TXD[3]) ; port MCU_MII.TXD3
MCU_MII.TXEN: U5000.E4(MII_TXEN) ; port MCU_MII.TXEN
MCU_SCI3.RX: U5000.W3(N2HET1[6]/SCI3RX/EPWM5A) ; port MCU_SCI3.RX
MCU_SCI3.TX: U5000.N2(N2HET1[13]/SCI3TX/N2HET2[20]/EPWM5B) ; port MCU_SCI3.TX
MCU_SCI4.RX: U5000.A13(N2HET1[17]/EMIF_NOE/SCI4RX) ; port MCU_SCI4.RX
MCU_SCI4.TX: U5000.B13(N2HET1[19]/EMIF_NDQM[0]/SCI4TX) ; port MCU_SCI4.TX
MCU_SMI.MDC: U5000.T9(MDCLK) ; port MCU_SMI.MDC
MCU_SMI.MDIO: U5000.F4(MDIO) ; port MCU_SMI.MDIO
MCU_SPI1~{.}CS1: U5000.F3(MIBSPI1NCS[1]/MII_COL/N2HET1[17]/EQEP1S) ; port MCU_SPI1.~{CS1}
MCU_SPI1~{.}CS2: U5000.G3(MIBSPI1NCS[2]/MDIO/N2HET1[19]) ; port MCU_SPI1.~{CS2}
MCU_SPI1~{.}CS3: U5000.J3(MIBSPI1NCS[3]/N2HET1[21]/NTZ1_3) ; port MCU_SPI1.~{CS3}
MCU_SPI1~{.}CS4: U5000.U10(MIBSPI1NCS[4]) ; port MCU_SPI1.~{CS4}
MCU_SPI1~{.}CS5: U5000.U9(MIBSPI1NCS[5]) ; port MCU_SPI1.~{CS5}
MCU_SPI1.CLK: U5000.F18(MIBSPI1CLK) ; port MCU_SPI1.CLK
MCU_SPI1.SIMO0: U5000.F19(MIBSPI1SIMO[0]) ; port MCU_SPI1.SIMO0
MCU_SPI1.SIMO1: U5000.E18(N2HET1[8]/MIBSPI1SIMO[1]/MII_TXD[3]) ; port MCU_SPI1.SIMO1
MCU_SPI1.SOMI0: U5000.G18(MIBSPI1SOMI[0]) ; port MCU_SPI1.SOMI0
MCU_SPI1.SOMI1: U5000.R2(MIBSPI1NCS[0]/MIBSPI1SOMI[1]/MII_TXD[2]/ECAP6) ; port MCU_SPI1.SOMI1
MCU_SPI2~{.}CS0: U5000.N3(N2HET2[7]/MIBSPI2NCS[0]) ; port MCU_SPI2.~{CS0}
MCU_SPI2~{.}CS1: U5000.D3(N2HET2[12]/MIBSPI2NENA/MIBSPI2NCS[1]) ; port MCU_SPI2.~{CS1}
MCU_SPI2.CLK: U5000.E2(N2HET2[3]/MIBSPI2CLK) ; port MCU_SPI2.CLK
MCU_SPI2.SIMO: U5000.D1(N2HET2[14]/MIBSPI2SIMO) ; port MCU_SPI2.SIMO
MCU_SPI2.SOMI: U5000.D2(N2HET2[13]/MIBSPI2SOMI) ; port MCU_SPI2.SOMI
MCU_SPI3~{.}CS4: U5000.E3(N2HET1[11]/MIBSPI3NCS[4]/N2HET2[18]/EPWM1SYNCO) ; port MCU_SPI3.~{CS4}
MCU_SPI3~{.}CS5: U5000.W9(MIBSPI3NENA/MIBSPI3NCS[5]/N2HET1[31]/EQEP1B) ; port MCU_SPI3.~{CS5}
MCU_SPI4~{.}CS0: U5000.U1(N2HET1[3]/MIBSPI4NCS[0]/N2HET2[10]/EQEP2B) ; port MCU_SPI4.~{CS0}
MCU_SPI4~{.}CS1: U5000.B12(N2HET1[4]/MIBSPI4NCS[1]/EPWM4B) ; port MCU_SPI4.~{CS1}
MCU_SPI4~{.}CS2: U5000.T1(N2HET1[7]/MIBSPI4NCS[2]/N2HET2[14]/EPWM7B) ; port MCU_SPI4.~{CS2}
MCU_SPI4~{.}CS3: U5000.V7(N2HET1[9]/MIBSPI4NCS[3]/N2HET2[16]/EPWM7A) ; port MCU_SPI4.~{CS3}
MCU_SPI4~{.}CS4: U5000.D19(N2HET1[10]/MIBSPI4NCS[4]/MII_TXCLK/MII_TX_AVCLK4/NTZ1_3) ; port MCU_SPI4.~{CS4}
MCU_SPI4~{.}CS5: U5000.B4(N2HET1[12]/MIBSPI4NCS[5]/MII_CRS/RMII_CRS_DV) ; port MCU_SPI4.~{CS5}
MCU_SPI4.CLK: U5000.K18(N2HET1[0]/MIBSPI4CLK/EPWM2B) ; port MCU_SPI4.CLK
MCU_SPI4.SIMO: U5000.W5(N2HET1[2]/MIBSPI4SIMO/EPWM3A) ; port MCU_SPI4.SIMO
MCU_SPI4.SOMI: U5000.V6(N2HET1[5]/MIBSPI4SOMI/N2HET2[12]/EPWM3B) ; port MCU_SPI4.SOMI
MCU_SPI5~{.}CS0: U5000.E19(MIBSPI5NCS[0]/DMM_DATA[5]/EPWM4A) ; port MCU_SPI5.~{CS0}
MCU_SPI5~{.}CS1: U5000.B6(MIBSPI5NCS[1]/DMM_DATA[6]) ; port MCU_SPI5.~{CS1}
MCU_SPI5~{.}CS2: U5000.W6(MIBSPI5NCS[2]/DMM_DATA[2]) ; port MCU_SPI5.~{CS2}
MCU_SPI5~{.}CS3: U5000.T12(MIBSPI5NCS[3]/DMM_DATA[3]) ; port MCU_SPI5.~{CS3}
MCU_SPI5.CLK: U5000.H19(MIBSPI5CLK/DMM_DATA[4]/MII_TXEN/RMII_TXEN) ; port MCU_SPI5.CLK
MCU_SPI5.SIMO0: U5000.J19(MIBSPI5SIMO[0]/DMM_DATA[8]/MII_TXD[1]/RMII_TXD[1]) ; port MCU_SPI5.SIMO0
MCU_SPI5.SIMO1: U5000.E16(MIBSPI5SIMO[1]/DMM_DATA[9]/AD1EXT_SEL[0]) ; port MCU_SPI5.SIMO1
MCU_SPI5.SIMO2: U5000.H17(MIBSPI5SIMO[2]/DMM_DATA[10]/AD1EXT_SEL[1]) ; port MCU_SPI5.SIMO2
MCU_SPI5.SIMO3: U5000.G17(MIBSPI5SIMO[3]/DMM_DATA[11]/I2C2_SDA/AD1EXT_SEL[2]) ; port MCU_SPI5.SIMO3
MCU_SPI5.SOMI0: U5000.J18(MIBSPI5SOMI[0]/DMM_DATA[12]/MII_TXD[0]/RMII_TXD[0]) ; port MCU_SPI5.SOMI0
MCU_SPI5.SOMI1: U5000.E17(MIBSPI5SOMI[1]/DMM_DATA[13]/AD1EXT_SEL[3]) ; port MCU_SPI5.SOMI1
MCU_SPI5.SOMI2: U5000.H16(MIBSPI5SOMI[2]/DMM_DATA[14]/AD1EXT_SEL[4]) ; port MCU_SPI5.SOMI2
MCU_SPI5.SOMI3: U5000.G16(MIBSPI5SOMI[3]/DMM_DATA[15]/I2C2_SCL/AD1EXT_ENA) ; port MCU_SPI5.SOMI3
NetD5000_2: D5000.2(A) R5000.1

### Buses and harness runs
harness MCU_GIOX = port MCU_GIOX

### Layout directives
net class MCU_CAN: (no net found under the mark)
net class MCU_FRAY: (no net found under the mark)
net class MCU_SPI1: (no net found under the mark)
net class MCU_SPI3: ~{SPI3_sCS6}
net class MCU_SPI5: (no net found under the mark)
net class MCU_SPI2: ~{SPI2_sCS2}
net class MCU_SPI4: (no net found under the mark)
net class MCU_LIN: (no net found under the mark)
net class MCU_I2C: (no net found under the mark)

### Notes on the sheet
- standard IOs on TMS:
- Debug LED
- Fraunhofer IISB
- Schottkystr. 10
- developed by:
- 91058 Erlangen
- Germany
- Author
- Project
- License
- Description
- File
- Version
- Release Date
- Sheet
- foxbms.org <https://foxbms.org>
- www.iisb.fraunhofer.de <https://www.iisb.fraunhofer.de/>
- foxBMS Team
- /

### Library data of the parts
D5000 = LED_0603_pure_green_AECQ: TLMP1100-GS08; Manufacturer: Vishay; Breakdown Voltage: 5V; Continuous Forward Current: 20mA; Forward Voltage @ 20mA: 2.1V; Automotive Qualified: True; Part Number: LED_0603_pure_green_AECQ; Color: pure green; Operating Temperature: -40°C - 100°C; ComponentLink1Description: Datasheet; ComponentLink1URL: http://www.farnell.com/datasheets/2049164.pdf; Supplier 1: Farnell; Supplier Part Number 1: 1328306; Supplier 2: Digikey; Supplier Part Number 2: 751-1176-1-ND; PnP Package: LED_0603
R5000 = gen_R_33R_0402: SMD Resistor 33R 0402; Tolerance: 1%; Power: 0.063W; Case EIA: 0402; Case Metric: 1005; Maximum Working Voltage: 50V; PnP Package: 0402R; Automotive Qualified: True; AEC-Q Grade: Grade 0; AEC-Q Norm: AEC-Q200; Part Number: gen_R_33R_0402; Operating Temperature: -55°C - +155°C; Resistance: 33R; Series: E24; PnP Value: 33R; ECCN: EAR99; Supplier 1: Digikey; Supplier Part Number 1: A129609CT-ND

## Sheet mcu-supply.SchDoc
size A3; DocumentNumber: 27; SheetNumber: 27; SheetTotal: 45; SheetDescription: MCU Power Supply
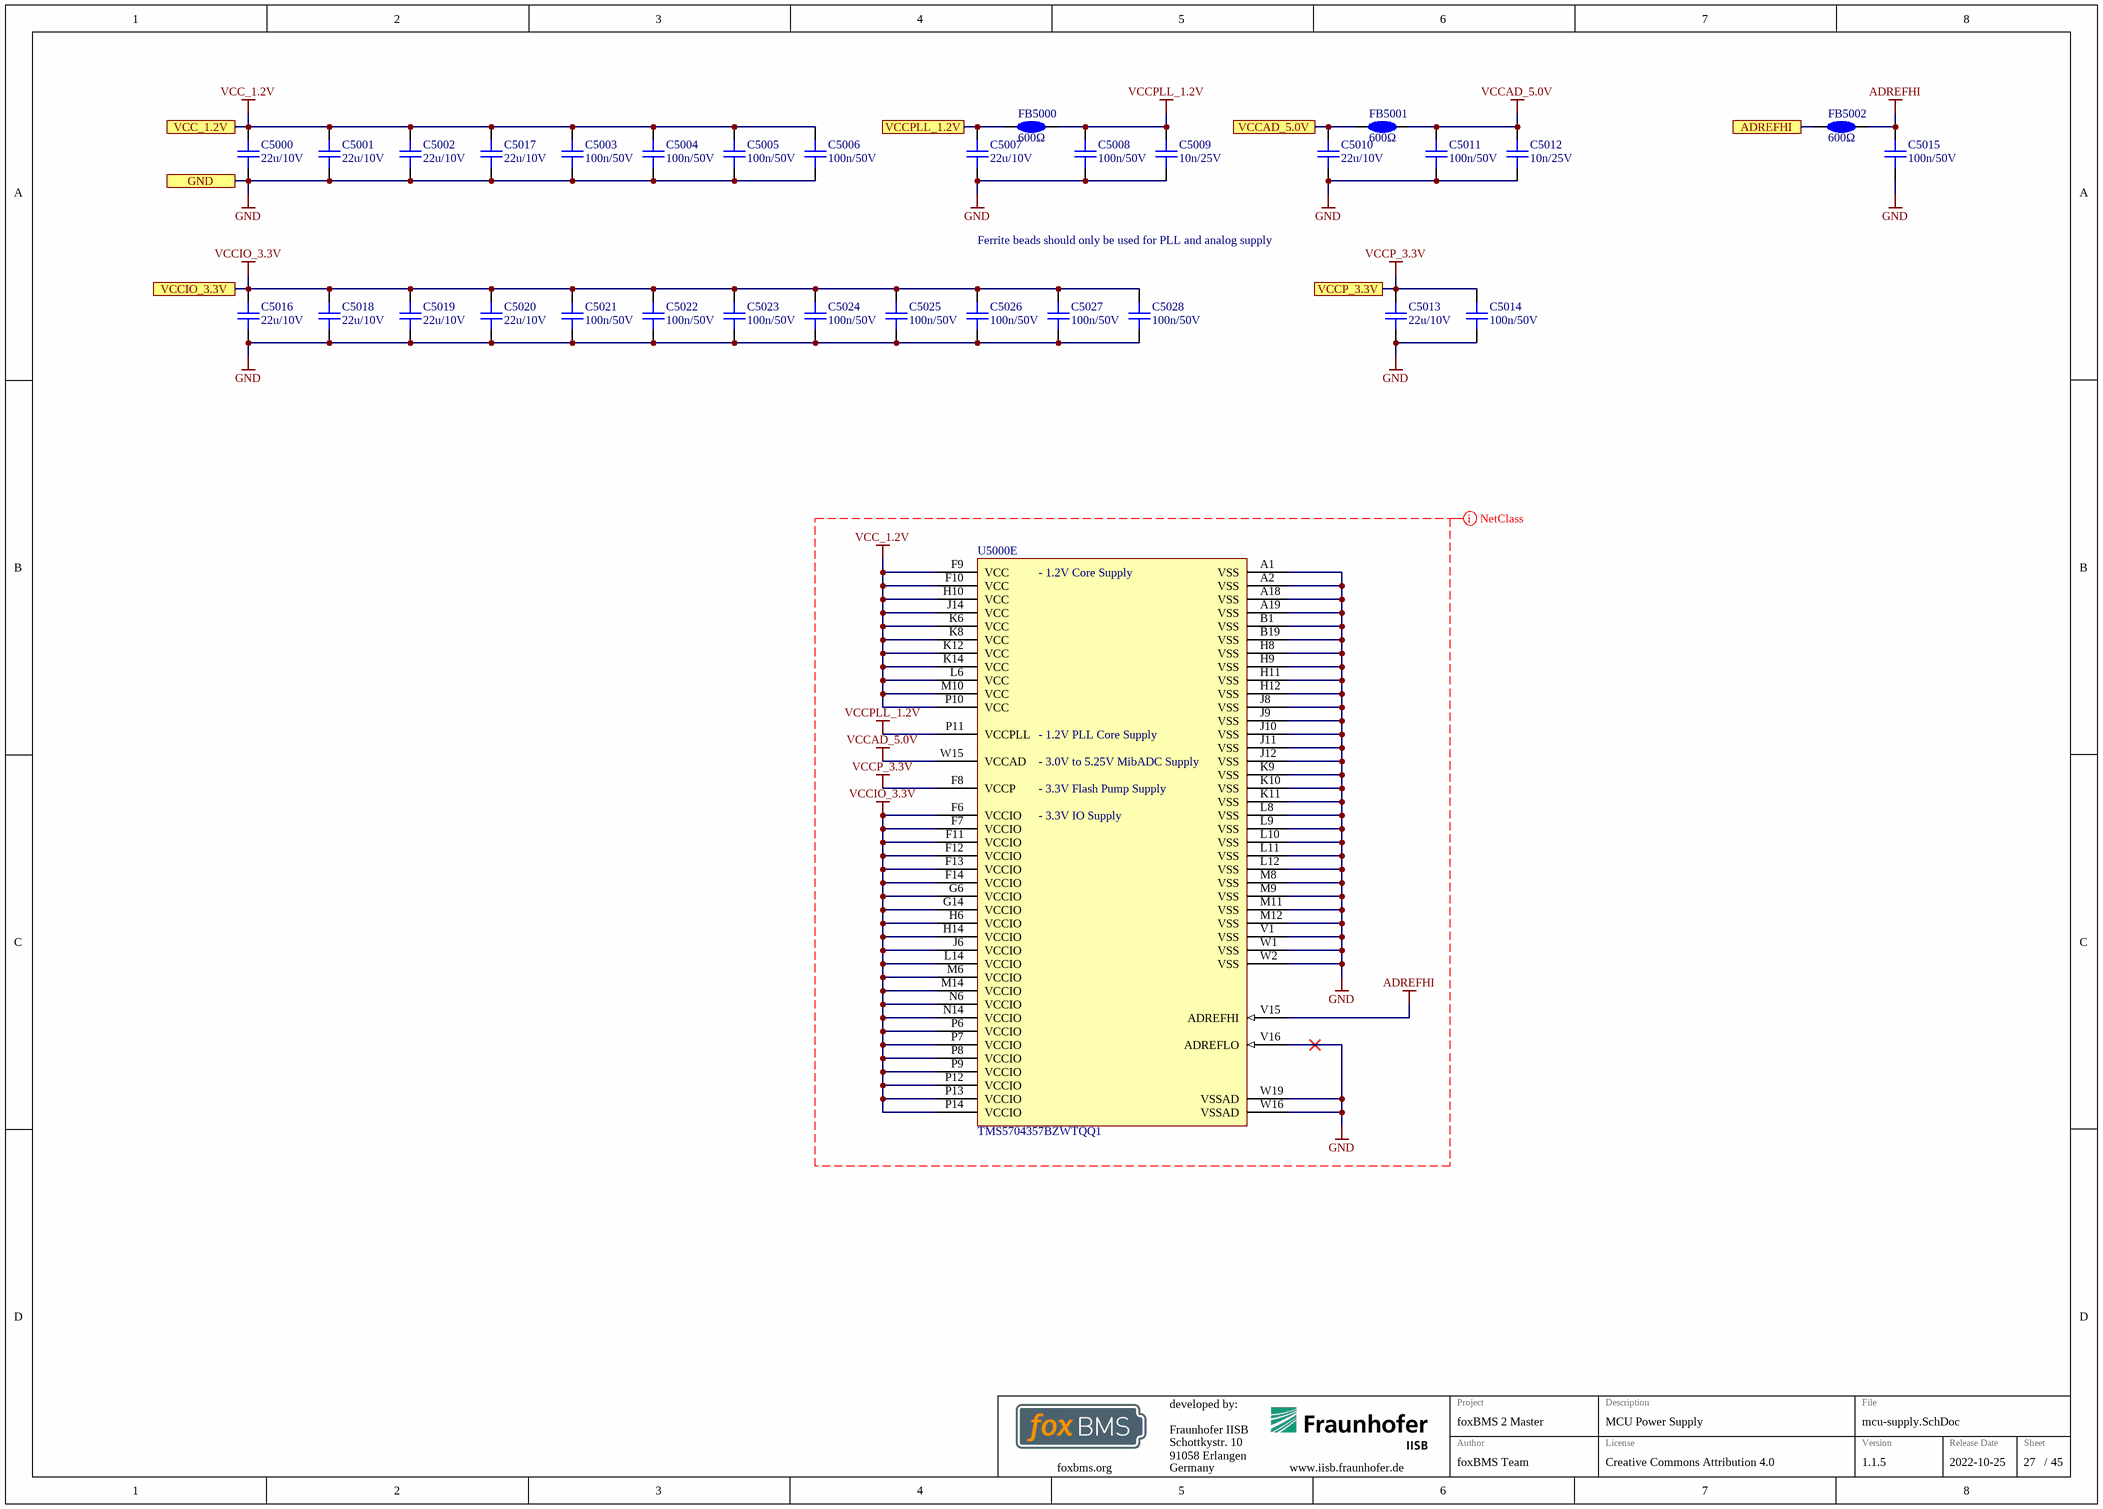
[diagram p3: mcu-supply.SchDoc]

### Parts
C5000  22u/10V  [CAPC3216X18N]
C5001  22u/10V  [CAPC3216X18N]
C5002  22u/10V  [CAPC3216X18N]
C5003  100n/50V  [CAPC1005X06N]
C5004  100n/50V  [CAPC1005X06N]
C5005  100n/50V  [CAPC1005X06N]
C5006  100n/50V  [CAPC1005X06N]
C5007  22u/10V  [CAPC3216X18N]
C5008  100n/50V  [CAPC1005X06N]
C5009  10n/25V  [CAPC1005X06N]
C5010  22u/10V  [CAPC3216X18N]
C5011  100n/50V  [CAPC1005X06N]
C5012  10n/25V  [CAPC1005X06N]
C5013  22u/10V  [CAPC3216X18N]
C5014  100n/50V  [CAPC1005X06N]
C5015  100n/50V  [CAPC1005X06N]
C5016  22u/10V  [CAPC3216X18N]
C5017  22u/10V  [CAPC3216X18N]
C5018  22u/10V  [CAPC3216X18N]
C5019  22u/10V  [CAPC3216X18N]
C5020  22u/10V  [CAPC3216X18N]
C5021  100n/50V  [CAPC1005X06N]
C5022  100n/50V  [CAPC1005X06N]
C5023  100n/50V  [CAPC1005X06N]
C5024  100n/50V  [CAPC1005X06N]
C5025  100n/50V  [CAPC1005X06N]
C5026  100n/50V  [CAPC1005X06N]
C5027  100n/50V  [CAPC1005X06N]
C5028  100n/50V  [CAPC1005X06N]
FB5000  600Ω  [RESC1005X04N]
FB5001  600Ω  [RESC1005X04N]
FB5002  600Ω  [RESC1005X04N]
U5000  TMS5704357BZWTQQ1  [BGA337C80P19X19_1600X1600X140]  (part E of 6)

### Ports
ADREFHI, GND, VCC_1.2V, VCCAD_5.0V, VCCIO_3.3V, VCCP_3.3V, VCCPLL_1.2V

### Nets
ADREFHI: C5015.2 FB5002.2 U5000.V15(ADREFHI)
GND: C5000.1 C5001.1 C5002.1 C5003.1 C5004.1 C5005.1 C5006.1 C5007.1 C5008.1 C5009.1 C5010.1 C5011.1 C5012.1 C5013.1 C5014.1 C5015.1 C5016.1 C5017.1 C5018.1 C5019.1 C5020.1 C5021.1 C5022.1 C5023.1 C5024.1 C5025.1 C5026.1 C5027.1 C5028.1 U5000.A1(VSS) U5000.A2(VSS) U5000.A18(VSS) U5000.A19(VSS) U5000.B1(VSS) U5000.B19(VSS) U5000.H8(VSS) U5000.H9(VSS) U5000.H11(VSS) U5000.H12(VSS) U5000.J8(VSS) U5000.J9(VSS) U5000.J10(VSS) U5000.J11(VSS) U5000.J12(VSS) U5000.K9(VSS) U5000.K10(VSS) U5000.K11(VSS) U5000.L8(VSS) U5000.L9(VSS) U5000.L10(VSS) U5000.L11(VSS) U5000.L12(VSS) U5000.M8(VSS) U5000.M9(VSS) U5000.M11(VSS) U5000.M12(VSS) U5000.V1(VSS) U5000.V16(ADREFLO) U5000.W1(VSS) U5000.W2(VSS) U5000.W16(VSSAD) U5000.W19(VSSAD) ; port GND
MCU_1.2V_LDO: C5007.2 FB5000.1 ; port VCCPLL_1.2V
MCU_5.0V_LDO: C5010.2 FB5001.1 ; port VCCAD_5.0V
VCC_1.2V: C5000.2 C5001.2 C5002.2 C5003.2 C5004.2 C5005.2 C5006.2 C5017.2 U5000.F9(VCC) U5000.F10(VCC) U5000.H10(VCC) U5000.J14(VCC) U5000.K6(VCC) U5000.K8(VCC) U5000.K12(VCC) U5000.K14(VCC) U5000.L6(VCC) U5000.M10(VCC) U5000.P10(VCC) ; port VCC_1.2V  [project net MCU_1.2V]
VCCAD_5.0V: C5011.2 C5012.2 FB5001.2 U5000.W15(VCCAD)
VCCIO_3.3V: C5013.2 C5014.2 C5016.2 C5018.2 C5019.2 C5020.2 C5021.2 C5022.2 C5023.2 C5024.2 C5025.2 C5026.2 C5027.2 C5028.2 U5000.F6(VCCIO) U5000.F7(VCCIO) U5000.F8(VCCP) U5000.F11(VCCIO) U5000.F12(VCCIO) U5000.F13(VCCIO) U5000.F14(VCCIO) U5000.G6(VCCIO) U5000.G14(VCCIO) U5000.H6(VCCIO) U5000.H14(VCCIO) U5000.J6(VCCIO) U5000.L14(VCCIO) U5000.M6(VCCIO) U5000.M14(VCCIO) U5000.N6(VCCIO) U5000.N14(VCCIO) U5000.P6(VCCIO) U5000.P7(VCCIO) U5000.P8(VCCIO) U5000.P9(VCCIO) U5000.P12(VCCIO) U5000.P13(VCCIO) U5000.P14(VCCIO) ; port VCCP_3.3V, port VCCIO_3.3V  [also labelled VCCP_3.3V]  [project net MCU_3.3V]
VCCPLL_1.2V: C5008.2 C5009.2 FB5000.2 U5000.P11(VCCPLL)
VREF_5V: FB5002.1 ; port ADREFHI

### Layout directives
net class MCU_Supply: ADREFHI, GND, VCC_1.2V, VCCAD_5.0V, VCCIO_3.3V, VCCP_3.3V, VCCPLL_1.2V

### Notes on the sheet
- Ferrite beads should only be used for PLL and analog supply
- Fraunhofer IISB
- Schottkystr. 10
- developed by:
- 91058 Erlangen
- Germany
- Author
- Project
- License
- Description
- File
- Version
- Release Date
- Sheet
- foxbms.org <https://foxbms.org>
- www.iisb.fraunhofer.de <https://www.iisb.fraunhofer.de/>
- foxBMS Team
- /
- (in symbol TMS5704357BZWTQQ1, part E) - 1.2V Core Supply; - 1.2V PLL Core Supply; - 3.0V to 5.25V MibADC Supply; - 3.3V Flash Pump Supply; - 3.3V IO Supply

### Library data of the parts
C5000-C5002 C5007 C5010 C5013 C5016-C5020 = gen_C_ceramic_22u_10V_X7R_1206: MLCC; Capacitance: 22u; Rated Voltage: 10V; Dielectric: X7R; Case EIA: 1206; Case Metric: 3216; Automotive Qualified: True; Part Number: gen_C_ceramic_22u_10V_X7R_1206; Supplier 1: Digikey; Supplier Part Number 1: 587-4243-1-ND
C5003-C5006 C5008 C5011 C5014 C5015 C5021-C5028 = gen_C_ceramic_100n_50V_X7R_0402: MLCC; Capacitance: 100n; Rated Voltage: 50V; Dielectric: X7R; Case EIA: 0402; Case Metric: 1005; PnP Package: 0402C; PnP Value: 100nF/50V/X7R; PnP equipped: x; Automotive Qualified: True; AEC-Q Norm: AEC-Q200; Part Number: gen_C_ceramic_100n_50V_X7R_0402; Supplier 1: Farnell; Supplier Part Number 1: 2210822; ECCN: EAR99
C5009 C5012 = gen_C_ceramic_10n_25V_X7R_0402: MLCC; Capacitance: 10n; Rated Voltage: 25V; Dielectric: X7R; Case EIA: 0402; Case Metric: 1005; Automotive Qualified: True; PnP Package: 0402C; PnP Value: 10nF/25V/X7R; PnP equipped: x; Part Number: gen_C_ceramic_10n_25V_X7R_0402; Supplier 1: Farnell; Supplier Part Number 1: 2210793
FB5000-FB5002 = gen_Ferrite_600R_0402: Ferrite Bead; Manufacturer: TDK; Saturation Current: 200mA; Automotive Qualified: True; Part Number: gen_Ferrite_600R_0402; Operating Temperature: -55°C - +125°C; Inductance: 600Ω; Supplier 1: Digikey; Supplier Part Number 1: 445-172776-1-ND; Supplier 2: Mouser; Supplier Part Number 2: 810-MMZ1005B601CTD25

## Sheet mcu-emif-etm-dmm.SchDoc
size A3; DocumentNumber: 25; SheetNumber: 25; SheetTotal: 45; SheetDescription: MCU EMIF, ETM and DMM
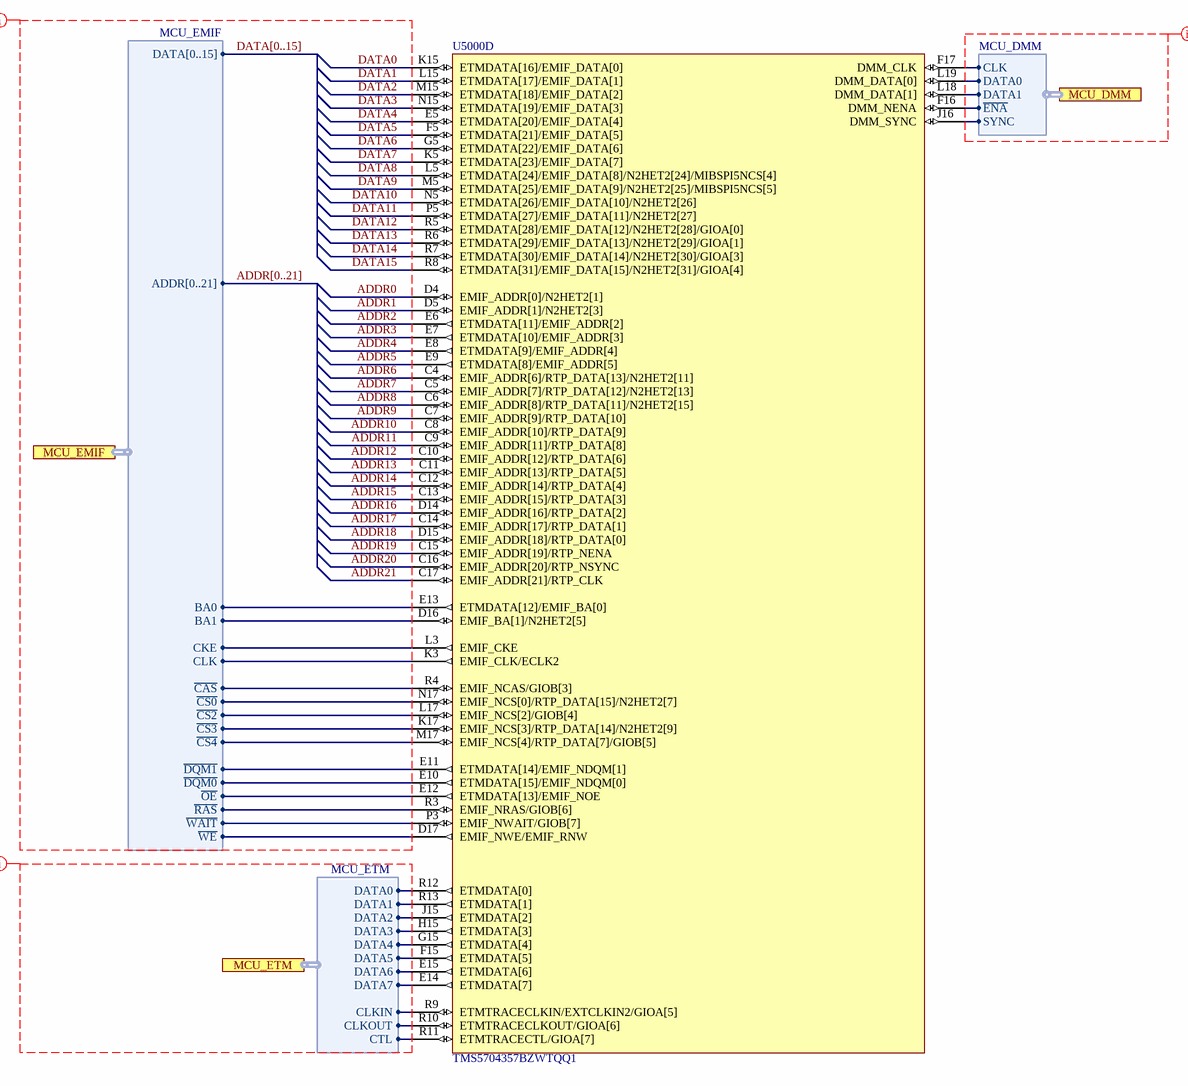
[diagram p4: mcu-emif-etm-dmm.SchDoc]

### Parts
U5000  TMS5704357BZWTQQ1  [BGA337C80P19X19_1600X1600X140]  (part D of 6)

### Ports
MCU_DMM (harness MCU_DMM), MCU_EMIF (harness MCU_EMIF), MCU_ETM (harness MCU_ETM)

### Harnesses
MCU_ETM: CLKOUT, CTL, CLKIN, DATA0, DATA1, DATA2, DATA3, DATA4, DATA5, DATA6, DATA7
MCU_DMM: CLK, DATA0, DATA1, SYNC, ~{ENA}
MCU_EMIF: DATA[0..15], ADDR[0..21], BA0, BA1, CKE, CLK, ~{CAS}, ~{CS0}, ~{CS2}, ~{CS3}, ~{CS4}, ~{DQM1}, ~{DQM0}, ~{OE}, ~{RAS}, ~{WAIT}, ~{WE}

### Nets
ADDR0: U5000.D4(EMIF_ADDR[0]/N2HET2[1])
ADDR1: U5000.D5(EMIF_ADDR[1]/N2HET2[3])
ADDR2: U5000.E6(ETMDATA[11]/EMIF_ADDR[2])
ADDR3: U5000.E7(ETMDATA[10]/EMIF_ADDR[3])
ADDR4: U5000.E8(ETMDATA[9]/EMIF_ADDR[4])
ADDR5: U5000.E9(ETMDATA[8]/EMIF_ADDR[5])
ADDR6: U5000.C4(EMIF_ADDR[6]/RTP_DATA[13]/N2HET2[11])
ADDR7: U5000.C5(EMIF_ADDR[7]/RTP_DATA[12]/N2HET2[13])
ADDR8: U5000.C6(EMIF_ADDR[8]/RTP_DATA[11]/N2HET2[15])
ADDR9: U5000.C7(EMIF_ADDR[9]/RTP_DATA[10])
ADDR10: U5000.C8(EMIF_ADDR[10]/RTP_DATA[9])
ADDR11: U5000.C9(EMIF_ADDR[11]/RTP_DATA[8])
ADDR12: U5000.C10(EMIF_ADDR[12]/RTP_DATA[6])
ADDR13: U5000.C11(EMIF_ADDR[13]/RTP_DATA[5])
ADDR14: U5000.C12(EMIF_ADDR[14]/RTP_DATA[4])
ADDR15: U5000.C13(EMIF_ADDR[15]/RTP_DATA[3])
ADDR16: U5000.D14(EMIF_ADDR[16]/RTP_DATA[2])
ADDR17: U5000.C14(EMIF_ADDR[17]/RTP_DATA[1])
ADDR18: U5000.D15(EMIF_ADDR[18]/RTP_DATA[0])
ADDR19: U5000.C15(EMIF_ADDR[19]/RTP_NENA)
ADDR20: U5000.C16(EMIF_ADDR[20]/RTP_NSYNC)
ADDR21: U5000.C17(EMIF_ADDR[21]/RTP_CLK)
DATA0: U5000.K15(ETMDATA[16]/EMIF_DATA[0])
DATA1: U5000.L15(ETMDATA[17]/EMIF_DATA[1])
DATA2: U5000.M15(ETMDATA[18]/EMIF_DATA[2])
DATA3: U5000.N15(ETMDATA[19]/EMIF_DATA[3])
DATA4: U5000.E5(ETMDATA[20]/EMIF_DATA[4])
DATA5: U5000.F5(ETMDATA[21]/EMIF_DATA[5])
DATA6: U5000.G5(ETMDATA[22]/EMIF_DATA[6])
DATA7: U5000.K5(ETMDATA[23]/EMIF_DATA[7])
DATA8: U5000.L5(ETMDATA[24]/EMIF_DATA[8]/N2HET2[24]/MIBSPI5NCS[4])
DATA9: U5000.M5(ETMDATA[25]/EMIF_DATA[9]/N2HET2[25]/MIBSPI5NCS[5])
DATA10: U5000.N5(ETMDATA[26]/EMIF_DATA[10]/N2HET2[26])
DATA11: U5000.P5(ETMDATA[27]/EMIF_DATA[11]/N2HET2[27])
DATA12: U5000.R5(ETMDATA[28]/EMIF_DATA[12]/N2HET2[28]/GIOA[0])
DATA13: U5000.R6(ETMDATA[29]/EMIF_DATA[13]/N2HET2[29]/GIOA[1])
DATA14: U5000.R7(ETMDATA[30]/EMIF_DATA[14]/N2HET2[30]/GIOA[3])
DATA15: U5000.R8(ETMDATA[31]/EMIF_DATA[15]/N2HET2[31]/GIOA[4])
MCU_DMM~{.}ENA: U5000.F16(DMM_NENA) ; port MCU_DMM.~{ENA}
MCU_DMM.CLK: U5000.F17(DMM_CLK) ; port MCU_DMM.CLK
MCU_DMM.DATA0: U5000.L19(DMM_DATA[0]) ; port MCU_DMM.DATA0
MCU_DMM.DATA1: U5000.L18(DMM_DATA[1]) ; port MCU_DMM.DATA1
MCU_DMM.SYNC: U5000.J16(DMM_SYNC) ; port MCU_DMM.SYNC
MCU_EMIF~{.}CAS: U5000.R4(EMIF_NCAS/GIOB[3]) ; port MCU_EMIF.~{CAS}
MCU_EMIF~{.}CS0: U5000.N17(EMIF_NCS[0]/RTP_DATA[15]/N2HET2[7]) ; port MCU_EMIF.~{CS0}
MCU_EMIF~{.}CS2: U5000.L17(EMIF_NCS[2]/GIOB[4]) ; port MCU_EMIF.~{CS2}
MCU_EMIF~{.}CS3: U5000.K17(EMIF_NCS[3]/RTP_DATA[14]/N2HET2[9]) ; port MCU_EMIF.~{CS3}
MCU_EMIF~{.}CS4: U5000.M17(EMIF_NCS[4]/RTP_DATA[7]/GIOB[5]) ; port MCU_EMIF.~{CS4}
MCU_EMIF~{.}DQM0: U5000.E10(ETMDATA[15]/EMIF_NDQM[0]) ; port MCU_EMIF.~{DQM0}
MCU_EMIF~{.}DQM1: U5000.E11(ETMDATA[14]/EMIF_NDQM[1]) ; port MCU_EMIF.~{DQM1}
MCU_EMIF~{.}OE: U5000.E12(ETMDATA[13]/EMIF_NOE) ; port MCU_EMIF.~{OE}
MCU_EMIF~{.}RAS: U5000.R3(EMIF_NRAS/GIOB[6]) ; port MCU_EMIF.~{RAS}
MCU_EMIF~{.}WAIT: U5000.P3(EMIF_NWAIT/GIOB[7]) ; port MCU_EMIF.~{WAIT}
MCU_EMIF~{.}WE: U5000.D17(EMIF_NWE/EMIF_RNW) ; port MCU_EMIF.~{WE}
MCU_EMIF.BA0: U5000.E13(ETMDATA[12]/EMIF_BA[0]) ; port MCU_EMIF.BA0
MCU_EMIF.BA1: U5000.D16(EMIF_BA[1]/N2HET2[5]) ; port MCU_EMIF.BA1
MCU_EMIF.CKE: U5000.L3(EMIF_CKE) ; port MCU_EMIF.CKE
MCU_EMIF.CLK: U5000.K3(EMIF_CLK/ECLK2) ; port MCU_EMIF.CLK
MCU_ETM.CLKIN: U5000.R9(ETMTRACECLKIN/EXTCLKIN2/GIOA[5]) ; port MCU_ETM.CLKIN
MCU_ETM.CLKOUT: U5000.R10(ETMTRACECLKOUT/GIOA[6]) ; port MCU_ETM.CLKOUT
MCU_ETM.CTL: U5000.R11(ETMTRACECTL/GIOA[7]) ; port MCU_ETM.CTL
MCU_ETM.DATA0: U5000.R12(ETMDATA[0]) ; port MCU_ETM.DATA0
MCU_ETM.DATA1: U5000.R13(ETMDATA[1]) ; port MCU_ETM.DATA1
MCU_ETM.DATA2: U5000.J15(ETMDATA[2]) ; port MCU_ETM.DATA2
MCU_ETM.DATA3: U5000.H15(ETMDATA[3]) ; port MCU_ETM.DATA3
MCU_ETM.DATA4: U5000.G15(ETMDATA[4]) ; port MCU_ETM.DATA4
MCU_ETM.DATA5: U5000.F15(ETMDATA[5]) ; port MCU_ETM.DATA5
MCU_ETM.DATA6: U5000.E15(ETMDATA[6]) ; port MCU_ETM.DATA6
MCU_ETM.DATA7: U5000.E14(ETMDATA[7]) ; port MCU_ETM.DATA7

### Buses and harness runs
bus ADDR[0..21]
bus DATA[0..15]

### Layout directives
net class MCU_EMIF: ADDR0, ADDR1, ADDR2, ADDR3, ADDR4, ADDR5, ADDR6, ADDR7, ADDR8, ADDR9, ADDR10, ADDR11, ADDR12, ADDR13, ADDR14, ADDR15, ADDR16, ADDR17, ADDR18, ADDR19, ADDR20, ADDR21, ADDR[0..21], DATA0, DATA1, DATA2, DATA3, DATA4, DATA5, DATA6, DATA7, DATA8, DATA9, DATA10, DATA11, DATA12, DATA13, DATA14, DATA15, DATA[0..15]
net class MCU_ETM: (no net found under the mark)
net class MCU_DMM: (no net found under the mark)

### Notes on the sheet
- Fraunhofer IISB
- Schottkystr. 10
- developed by:
- 91058 Erlangen
- Germany
- Author
- Project
- License
- Description
- File
- Version
- Release Date
- Sheet
- foxbms.org <https://foxbms.org>
- www.iisb.fraunhofer.de <https://www.iisb.fraunhofer.de/>
- foxBMS Team
- /

## Sheet mcu-misc.SchDoc
size A3; DocumentNumber: 26; SheetNumber: 26; SheetTotal: 45; SheetDescription: MCU Clock, JTAG, Error and Reset
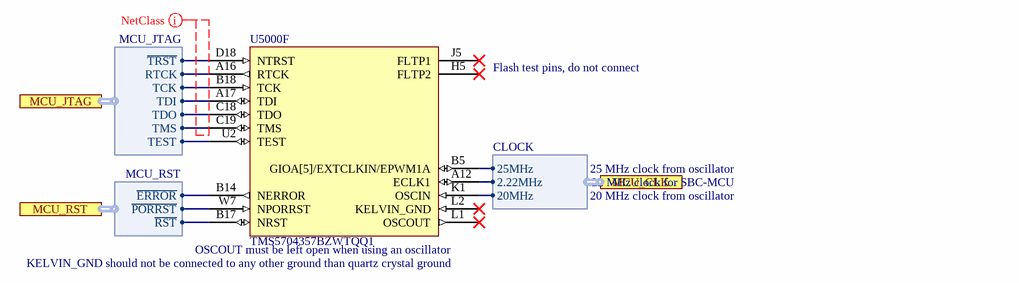
[diagram p5: mcu-misc.SchDoc]

### Parts
U5000  TMS5704357BZWTQQ1  [BGA337C80P19X19_1600X1600X140]  (part F of 6)

### Ports
MCU_CLK (harness CLOCK), MCU_JTAG (harness MCU_JTAG), MCU_RST (harness MCU_RST)

### Harnesses
MCU_JTAG: ~{TRST}, RTCK, TCK, TDI, TDO, TMS, TEST
CLOCK: 2.22MHz, 20MHz, 25MHz
MCU_RST: ~{ERROR}, ~{PORRST}, ~{RST}

### Nets
GND: U5000.U2(TEST) ; port MCU_JTAG.TEST
~{DBG_RESET}: U5000.B17(NRST) ; port MCU_RST.~{RST}
EXT_CON~{.}SBC_MCU_PGOOD: U5000.W7(NPORRST) ; port MCU_RST.~{PORRST}
EXT_CON.ADC_CLK: U5000.K1(OSCIN) ; port MCU_CLK.20MHz
MCU_CLK.2.22MHz: U5000.A12(ECLK1) ; port MCU_CLK.2.22MHz
MCU_CLK.25MHz: U5000.B5(GIOA[5]/EXTCLKIN/EPWM1A) ; port MCU_CLK.25MHz
MCU_JTAG~{.}TRST: U5000.D18(NTRST) ; port MCU_JTAG.~{TRST}
MCU_JTAG.RTCK: U5000.A16(RTCK) ; port MCU_JTAG.RTCK
MCU_JTAG.TCK: U5000.B18(TCK) ; port MCU_JTAG.TCK
MCU_JTAG.TDI: U5000.A17(TDI) ; port MCU_JTAG.TDI
MCU_JTAG.TDO: U5000.C18(TDO) ; port MCU_JTAG.TDO
MCU_JTAG.TMS: U5000.C19(TMS) ; port MCU_JTAG.TMS
MCU_RST~{.}ERROR: U5000.B14(NERROR) ; port MCU_RST.~{ERROR}

Not connected (* = marked no-connect by the designer): U5000 H5(FLTP2)* J5(FLTP1)* L1(OSCOUT)* L2(KELVIN_GND)*

### Layout directives
net class MCU_JTAG: (no net found under the mark)

### Notes on the sheet
- Flash test pins, do not connect
- EXTCLKIN: 25 MHz clock from oscillator
- ECLK1: 2.22 MHz clock for SBC-MCU
- OSCIN: 20 MHz clock from oscillator
- (near U5000) KELVIN_GND should not be connected to any other ground than quartz crystal ground
- (near U5000) OSCOUT must be left open when using an oscillator
- Fraunhofer IISB
- Schottkystr. 10
- developed by:
- 91058 Erlangen
- Germany
- Author
- Project
- License
- Description
- File
- Version
- Release Date
- Sheet
- foxbms.org <https://foxbms.org>
- www.iisb.fraunhofer.de <https://www.iisb.fraunhofer.de/>
- foxBMS Team
- /

## Sheet mcu-adc.SchDoc
size A3; DocumentNumber: 23; SheetNumber: 23; SheetTotal: 45; SheetDescription: MCU ADC
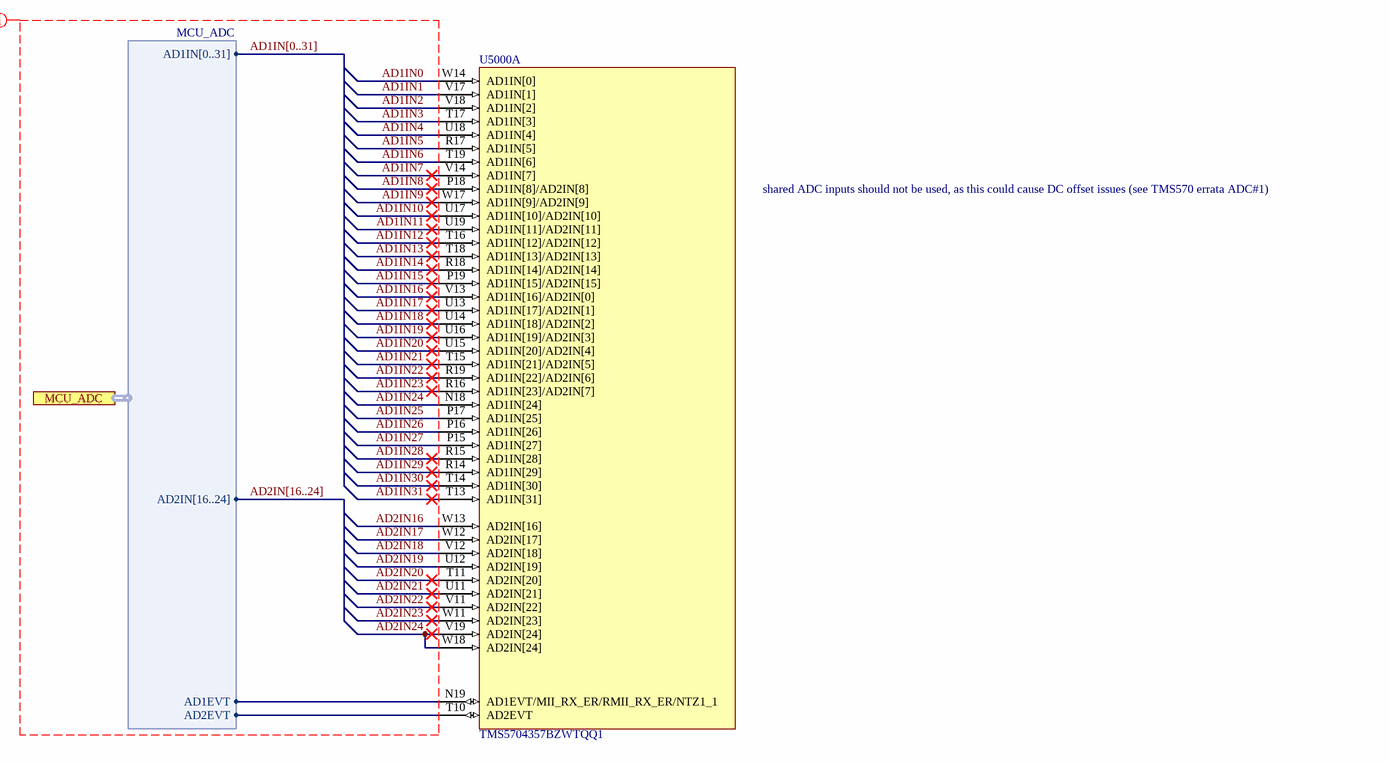
[diagram p6: mcu-adc.SchDoc]

### Parts
U5000  TMS5704357BZWTQQ1  [BGA337C80P19X19_1600X1600X140]  (part A of 6)

### Ports
MCU_ADC (harness MCU_ADC)

### Harnesses
MCU_ADC: AD2IN[16..24], AD1EVT, AD2EVT, AD1IN[0..31]

### Nets
AD1IN0: U5000.W14(AD1IN[0])  [project net SUPPLY_IO.SBC_MCU_ADC]
AD1IN1: U5000.V17(AD1IN[1])  [project net SUPPLY_IO.SBC_PER_ADC]
AD1IN2: U5000.V18(AD1IN[2])  [project net INTERLOCK_IO.IL_HS_VS]
AD1IN3: U5000.T17(AD1IN[3])  [project net INTERLOCK_IO.IL_LS_VS]
AD1IN4: U5000.U18(AD1IN[4])  [project net INTERLOCK_IO.IL_HS_CS]
AD1IN5: U5000.R17(AD1IN[5])  [project net INTERLOCK_IO.IL_LS_CS]
AD1IN6: U5000.T19(AD1IN[6])  [project net SUPPLY_IO.VSUP_30C_SENSE]
AD1IN7: U5000.V14(AD1IN[7])  [project net AD1IN7_21]
AD1IN8: U5000.P18(AD1IN[8]/AD2IN[8])  [project net AD1IN8_21]
AD1IN9: U5000.W17(AD1IN[9]/AD2IN[9])  [project net AD1IN9_21]
AD1IN10: U5000.U17(AD1IN[10]/AD2IN[10])  [project net AD1IN10_21]
AD1IN11: U5000.U19(AD1IN[11]/AD2IN[11])  [project net AD1IN11_21]
AD1IN12: U5000.T16(AD1IN[12]/AD2IN[12])  [project net AD1IN12_21]
AD1IN13: U5000.T18(AD1IN[13]/AD2IN[13])  [project net AD1IN13_21]
AD1IN14: U5000.R18(AD1IN[14]/AD2IN[14])  [project net AD1IN14_21]
AD1IN15: U5000.P19(AD1IN[15]/AD2IN[15])  [project net AD1IN15_21]
AD1IN16: U5000.V13(AD1IN[16]/AD2IN[0])  [project net AD1IN16_21]
AD1IN17: U5000.U13(AD1IN[17]/AD2IN[1])  [project net AD1IN17_21]
AD1IN18: U5000.U14(AD1IN[18]/AD2IN[2])  [project net AD1IN18_21]
AD1IN19: U5000.U16(AD1IN[19]/AD2IN[3])  [project net AD1IN19_21]
AD1IN20: U5000.U15(AD1IN[20]/AD2IN[4])  [project net AD1IN20_21]
AD1IN21: U5000.T15(AD1IN[21]/AD2IN[5])  [project net AD1IN21_21]
AD1IN22: U5000.R19(AD1IN[22]/AD2IN[6])  [project net AD1IN22_21]
AD1IN23: U5000.R16(AD1IN[23]/AD2IN[7])  [project net AD1IN23_21]
AD1IN24: U5000.N18(AD1IN[24])
AD1IN25: U5000.P17(AD1IN[25])
AD1IN26: U5000.P16(AD1IN[26])
AD1IN27: U5000.P15(AD1IN[27])
AD1IN28: U5000.R15(AD1IN[28])  [project net AD1IN28_21]
AD1IN29: U5000.R14(AD1IN[29])  [project net AD1IN29_21]
AD1IN30: U5000.T14(AD1IN[30])  [project net AD1IN30_21]
AD1IN31: U5000.T13(AD1IN[31])  [project net AD1IN31_21]
AD2IN16: U5000.W13(AD2IN[16])
AD2IN17: U5000.W12(AD2IN[17])
AD2IN18: U5000.V12(AD2IN[18])
AD2IN19: U5000.U12(AD2IN[19])
AD2IN20: U5000.T11(AD2IN[20])  [project net AD2IN20_21]
AD2IN21: U5000.U11(AD2IN[21])  [project net AD2IN21_21]
AD2IN22: U5000.V11(AD2IN[22])  [project net AD2IN22_21]
AD2IN23: U5000.W11(AD2IN[23])  [project net AD2IN23_21]
AD2IN24: U5000.V19(AD2IN[24]) U5000.W18(AD2IN[24])  [project net AD2IN24_21]
EXT_CON.AD1EVT: U5000.N19(AD1EVT/MII_RX_ER/RMII_RX_ER/NTZ1_1) ; port MCU_ADC.AD1EVT
EXT_CON.AD2EVT: U5000.T10(AD2EVT) ; port MCU_ADC.AD2EVT

### Buses and harness runs
bus AD1IN[0..31]
bus AD2IN[16..24]

### Layout directives
net class MCU_ADC: AD1IN0, AD1IN1, AD1IN2, AD1IN3, AD1IN4, AD1IN5, AD1IN6, AD1IN7, AD1IN8, AD1IN9, AD1IN10, AD1IN11, AD1IN12, AD1IN13, AD1IN14, AD1IN15, AD1IN16, AD1IN17, AD1IN18, AD1IN19, AD1IN20, AD1IN21, AD1IN22, AD1IN23, AD1IN24, AD1IN25, AD1IN26, AD1IN27, AD1IN28, AD1IN29, AD1IN30, AD1IN31, AD1IN[0..31], AD2IN16, AD2IN17, AD2IN18, AD2IN19, AD2IN20, AD2IN21, AD2IN22, AD2IN23, AD2IN24, AD2IN[16..24]

### Notes on the sheet
- shared ADC inputs should not be used, as this could cause DC offset issues (see TMS570 errata ADC#1)
- Fraunhofer IISB
- Schottkystr. 10
- developed by:
- 91058 Erlangen
- Germany
- Author
- Project
- License
- Description
- File
- Version
- Release Date
- Sheet
- foxbms.org <https://foxbms.org>
- www.iisb.fraunhofer.de <https://www.iisb.fraunhofer.de/>
- foxBMS Team
- /